# Altium project Hub_Unit - Copy.PrjPcb (part 1 of 2)
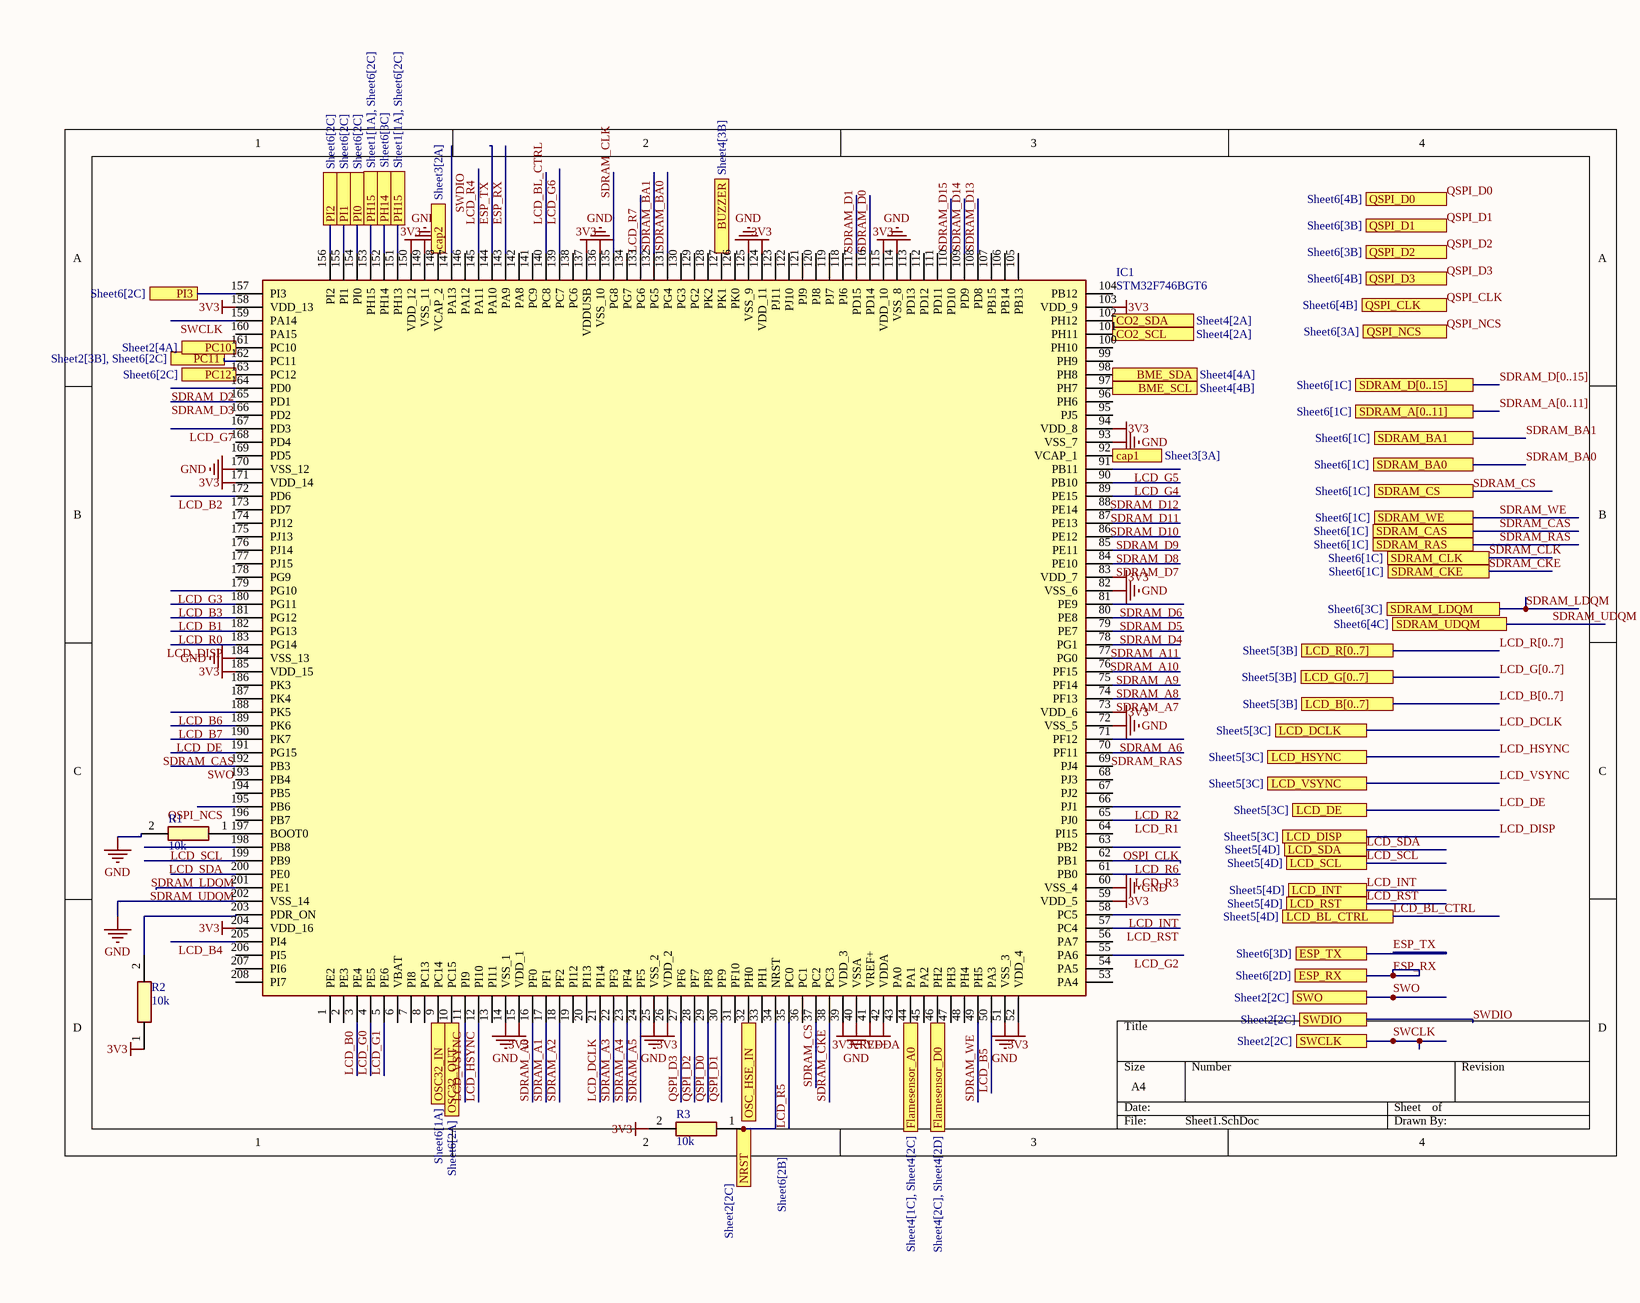
[diagram p0: Sheet1.SchDoc]
6 sheets, 122 parts. Net scope: flat (ports and power ports of the same name join across sheets).
Board file: PCB1.PcbDoc
Sheets:
  Sheet1.SchDoc
  Sheet2.SchDoc
  Sheet3.SchDoc
  Sheet4.SchDoc
  Sheet5.SchDoc
  Sheet6.SchDoc

## Sheet Sheet1.SchDoc
size A4; SheetNumber: 1; SheetTotal: 6

### Parts
IC1  STM32F746BGT6  [QFP50P3000X3000X160-208N]
R1  10k  [RESC1608X55N]
R2  10k  [RESC1608X55N]
R3  10k  [RESC1608X55N]

### Ports
BME_SCL (see Sheet4[4B]), BME_SDA (see Sheet4[4A]), BUZZER (see Sheet4[3B]), cap1 (see Sheet3[3A]), cap2 (see Sheet3[2A]), CO2_SCL (see Sheet4[2A]), CO2_SDA (see Sheet4[2A]), ESP_RX (see Sheet6[2D]), ESP_TX (see Sheet6[3D]), Flamesensor_A0 (see Sheet4[1C], Sheet4[2C]), Flamesensor_D0 (see Sheet4[2C], Sheet4[2D]), LCD_B[0..7] (see Sheet5[3B]), LCD_BL_CTRL (see Sheet5[4D]), LCD_DCLK (see Sheet5[3C]), LCD_DE (see Sheet5[3C]), LCD_DISP (see Sheet5[3C]), LCD_G[0..7] (see Sheet5[3B]), LCD_HSYNC (see Sheet5[3C]), LCD_INT (see Sheet5[4D]), LCD_R[0..7] (see Sheet5[3B]), LCD_RST (see Sheet5[4D]), LCD_SCL (see Sheet5[4D]), LCD_SDA (see Sheet5[4D]), LCD_VSYNC (see Sheet5[3C]), NRST (see Sheet2[2C]), OSC32_IN (see Sheet6[1A]), OSC32_OUT (see Sheet6[2A]), OSC_HSE_IN (see Sheet6[2B]), PC10 (see Sheet2[4A]), PC11 (see Sheet2[3B], Sheet6[2C]), PC12 (see Sheet6[2C]), PH14 (see Sheet6[3C]), PH15 (see Sheet1[1A], Sheet6[2C]), PI0 (see Sheet6[2C]), PI1 (see Sheet6[2C]), PI2 (see Sheet6[2C]), PI3 (see Sheet6[2C]), QSPI_CLK (see Sheet6[4B]), QSPI_D0 (see Sheet6[4B]), QSPI_D1 (see Sheet6[3B]), QSPI_D2 (see Sheet6[3B]), QSPI_D3 (see Sheet6[4B]), QSPI_NCS (see Sheet6[3A]), SDRAM_A[0..11] (see Sheet6[1C]), SDRAM_BA0 (see Sheet6[1C]), SDRAM_BA1 (see Sheet6[1C]), SDRAM_CAS (see Sheet6[1C]), SDRAM_CKE (see Sheet6[1C]), SDRAM_CLK (see Sheet6[1C]), SDRAM_CS (see Sheet6[1C]), SDRAM_D[0..15] (see Sheet6[1C]), SDRAM_LDQM (see Sheet6[3C]), SDRAM_RAS (see Sheet6[1C]), SDRAM_UDQM (see Sheet6[4C]), SDRAM_WE (see Sheet6[1C]), SWCLK (see Sheet2[2C]), SWDIO (see Sheet2[2C]), SWO (see Sheet2[2C])

### Nets
3V3: IC1.15(VDD_1) IC1.26(VDD_2) IC1.39(VDD_3) IC1.52(VDD_4) IC1.59(VDD_5) IC1.73(VDD_6) IC1.83(VDD_7) IC1.94(VDD_8) IC1.103(VDD_9) IC1.115(VDD_10) IC1.124(VDD_11) IC1.137(VDDUSB) IC1.150(VDD_12) IC1.158(VDD_13) IC1.171(VDD_14) IC1.185(VDD_15) IC1.204(VDD_16) R2.1 R3.2
GND: IC1.14(VSS_1) IC1.25(VSS_2) IC1.40(VSSA) IC1.51(VSS_3) IC1.60(VSS_4) IC1.72(VSS_5) IC1.82(VSS_6) IC1.93(VSS_7) IC1.114(VSS_8) IC1.125(VSS_9) IC1.136(VSS_10) IC1.149(VSS_11) IC1.170(VSS_12) IC1.184(VSS_13) IC1.202(VSS_14) R1.2
VDDA: IC1.42(VDDA)
VREF+: IC1.41(VREF+)
ESP_RX: IC1.143(PA9) ; port ESP_RX
ESP_TX: IC1.144(PA10) ; port ESP_TX
LCD_B0: IC1.3(PE4)
LCD_B1: IC1.181(PG12)
LCD_B2: IC1.172(PD6)
LCD_B3: IC1.180(PG11)
LCD_B4: IC1.205(PI4)
LCD_B5: IC1.50(PA3)
LCD_B6: IC1.188(PK5)
LCD_B7: IC1.189(PK6)
LCD_BL_CTRL: IC1.140(PC8) ; port LCD_BL_CTRL
LCD_DCLK: IC1.21(PI14) ; port LCD_DCLK
LCD_DE: IC1.190(PK7) ; port LCD_DE
LCD_DISP: IC1.183(PG14) ; port LCD_DISP
LCD_G0: IC1.4(PE5)
LCD_G1: IC1.5(PE6)
LCD_G2: IC1.55(PA6)
LCD_G3: IC1.179(PG10)
LCD_G4: IC1.90(PB10)
LCD_G5: IC1.91(PB11)
LCD_G6: IC1.139(PC7)
LCD_G7: IC1.167(PD3)
LCD_HSYNC: IC1.12(PI10) ; port LCD_HSYNC
LCD_INT: IC1.58(PC5) ; port LCD_INT
LCD_R0: IC1.182(PG13)
LCD_R1: IC1.65(PJ0)
LCD_R2: IC1.66(PJ1)
LCD_R3: IC1.61(PB0)
LCD_R4: IC1.145(PA11)
LCD_R5: IC1.35(PC0)
LCD_R6: IC1.62(PB1)
LCD_R7: IC1.133(PG6)
LCD_RST: IC1.57(PC4) ; port LCD_RST
LCD_SCL: IC1.198(PB8) ; port LCD_SCL
LCD_SDA: IC1.199(PB9) ; port LCD_SDA
LCD_VSYNC: IC1.11(PI9) ; port LCD_VSYNC
QSPI_CLK: IC1.63(PB2) ; port QSPI_CLK
QSPI_D0: IC1.29(PF8) ; port QSPI_D0
QSPI_D1: IC1.30(PF9) ; port QSPI_D1
QSPI_D2: IC1.28(PF7) ; port QSPI_D2
QSPI_D3: IC1.27(PF6) ; port QSPI_D3
QSPI_NCS: IC1.195(PB6) ; port QSPI_NCS
SDRAM_A0: IC1.16(PF0)
SDRAM_A1: IC1.17(PF1)
SDRAM_A2: IC1.18(PF2)
SDRAM_A3: IC1.22(PF3)
SDRAM_A4: IC1.23(PF4)
SDRAM_A5: IC1.24(PF5)
SDRAM_A6: IC1.71(PF12)
SDRAM_A7: IC1.74(PF13)
SDRAM_A8: IC1.75(PF14)
SDRAM_A9: IC1.76(PF15)
SDRAM_A10: IC1.77(PG0)
SDRAM_A11: IC1.78(PG1)
SDRAM_BA0: IC1.131(PG4) ; port SDRAM_BA0
SDRAM_BA1: IC1.132(PG5) ; port SDRAM_BA1
SDRAM_CAS: IC1.191(PG15) ; port SDRAM_CAS
SDRAM_CKE: IC1.38(PC3) ; port SDRAM_CKE
SDRAM_CLK: IC1.135(PG8) ; port SDRAM_CLK
SDRAM_CS: IC1.37(PC2) ; port SDRAM_CS
SDRAM_D0: IC1.116(PD14)
SDRAM_D1: IC1.117(PD15)
SDRAM_D2: IC1.164(PD0)
SDRAM_D3: IC1.165(PD1)
SDRAM_D4: IC1.79(PE7)
SDRAM_D5: IC1.80(PE8)
SDRAM_D6: IC1.81(PE9)
SDRAM_D7: IC1.84(PE10)
SDRAM_D8: IC1.85(PE11)
SDRAM_D9: IC1.86(PE12)
SDRAM_D10: IC1.87(PE13)
SDRAM_D11: IC1.88(PE14)
SDRAM_D12: IC1.89(PE15)
SDRAM_D13: IC1.108(PD8)
SDRAM_D14: IC1.109(PD9)
SDRAM_D15: IC1.110(PD10)
SDRAM_LDQM: IC1.200(PE0) ; port SDRAM_LDQM
SDRAM_RAS: IC1.70(PF11) ; port SDRAM_RAS
SDRAM_UDQM: IC1.201(PE1) ; port SDRAM_UDQM
SDRAM_WE: IC1.49(PH5) ; port SDRAM_WE
SWCLK: IC1.159(PA14) ; port SWCLK
SWDIO: IC1.147(PA13) ; port SWDIO
SWO: IC1.192(PB3) ; port SWO
NetC6_1: IC1.148(VCAP_2) ; port cap2
NetC7_1: IC1.92(VCAP_1) ; port cap1
NetC22_2: IC1.9(PC14) ; port OSC32_IN
NetC23_2: IC1.10(PC15) ; port OSC32_OUT
NetC41_2: IC1.44(PA1) ; port Flamesensor_A0
NetIC1_32: IC1.32(PH0) ; port OSC_HSE_IN
NetIC1_34: IC1.34(NRST) R3.1 ; port NRST
NetIC1_46: IC1.46(PH2) ; port Flamesensor_D0
NetIC1_97: IC1.97(PH7) ; port BME_SCL
NetIC1_98: IC1.98(PH8) ; port BME_SDA
NetIC1_101: IC1.101(PH11) ; port CO2_SCL
NetIC1_102: IC1.102(PH12) ; port CO2_SDA
NetIC1_127: IC1.127(PK1) ; port BUZZER
NetIC1_151: IC1.151(PH13) IC1.153(PH15) ; port PH15
NetIC1_152: IC1.152(PH14) ; port PH14
NetIC1_154: IC1.154(PI0) ; port PI0
NetIC1_155: IC1.155(PI1) ; port PI1
NetIC1_156: IC1.156(PI2) ; port PI2
NetIC1_157: IC1.157(PI3) ; port PI3
NetIC1_161: IC1.161(PC10) ; port PC10
NetIC1_162: IC1.162(PC11) ; port PC11
NetIC1_163: IC1.163(PC12) ; port PC12
NetIC1_197: IC1.197(BOOT0) R1.1
NetIC1_203: IC1.203(PDR_ON) R2.2

Not connected (* = marked no-connect by the designer): IC1 1(PE2) 2(PE3) 6(VBAT) 7(PI8) 8(PC13) 13(PI11) 19(PI12) 20(PI13) 31(PF10) 33(PH1) 36(PC1) 43(PA0) 45(PA2) 47(PH3) 48(PH4) 53(PA4) 54(PA5) 56(PA7) 64(PI15) 67(PJ2) 68(PJ3) 69(PJ4) 95(PJ5) 96(PH6) 99(PH9) 100(PH10) 104(PB12) 105(PB13) 106(PB14) 107(PB15) 111(PD11) 112(PD12) 113(PD13) 118(PJ6) 119(PJ7) 120(PJ8) 121(PJ9) 122(PJ10) 123(PJ11) 126(PK0) 128(PK2) 129(PG2) 130(PG3) 134(PG7) 138(PC6) 141(PC9) 142(PA8) 146(PA12) 160(PA15) 166(PD2) 168(PD4) 169(PD5) 173(PD7) 174(PJ12) 175(PJ13) 176(PJ14) 177(PJ15) 178(PG9) 186(PK3) 187(PK4) 193(PB4) 194(PB5) 196(PB7) 206(PI5) 207(PI6) 208(PI7)

### Buses and harness runs
bus LCD_B[0..7] = port LCD_B[0..7]
bus LCD_G[0..7] = port LCD_G[0..7]
bus LCD_R[0..7] = port LCD_R[0..7]
bus SDRAM_A[0..11] = port SDRAM_A[0..11]
bus SDRAM_D[0..15] = port SDRAM_D[0..15]

### Library data of the parts
IC1 = STM32F746BGT6: Integrated Circuit; Manufacturer_Name: STMicroelectronics; Datasheet Link: https://www.st.com/resource/en/datasheet/stm32f746bg.pdf; Height: 1.6mm; Manufacturer_Part_Number: STM32F746BGT6; Mouser Part Number: 511-STM32F746BGT6; Mouser Price/Stock: https://www.mouser.co.uk/ProductDetail/STMicroelectronics/STM32F746BGT6?qs=E2FFEhwHWtcSD54rSf3kgw%3D%3D; Arrow Part Number: STM32F746BGT6; Arrow Price/Stock: https://www.arrow.com/en/products/stm32f746bgt6/stmicroelectronics?utm_currency=USD&region=nac
R1-R3 = RC0603FR-071KL: Resistor; Manufacturer_Name: YAGEO; Datasheet Link: https://www.yageo.com/upload/media/product/productsearch/datasheet/rchip/PYu-RC_Group_51_RoHS_L_12.pdf; Height: 0.55mm; Manufacturer_Part_Number: RC0603FR-071KL; Mouser Part Number: 603-RC0603FR-071KL; Mouser Price/Stock: https://www.mouser.co.uk/ProductDetail/YAGEO/RC0603FR-071KL?qs=VU8sRB4EgwApHsk4rF%2F3zg%3D%3D; Arrow Part Number: RC0603FR-071KL; Arrow Price/Stock: https://www.arrow.com/en/products/rc0603fr-071kl/yageo?utm_currency=USD&region=nac

## Sheet Sheet2.SchDoc
size A4; SheetNumber: 2; SheetTotal: 6
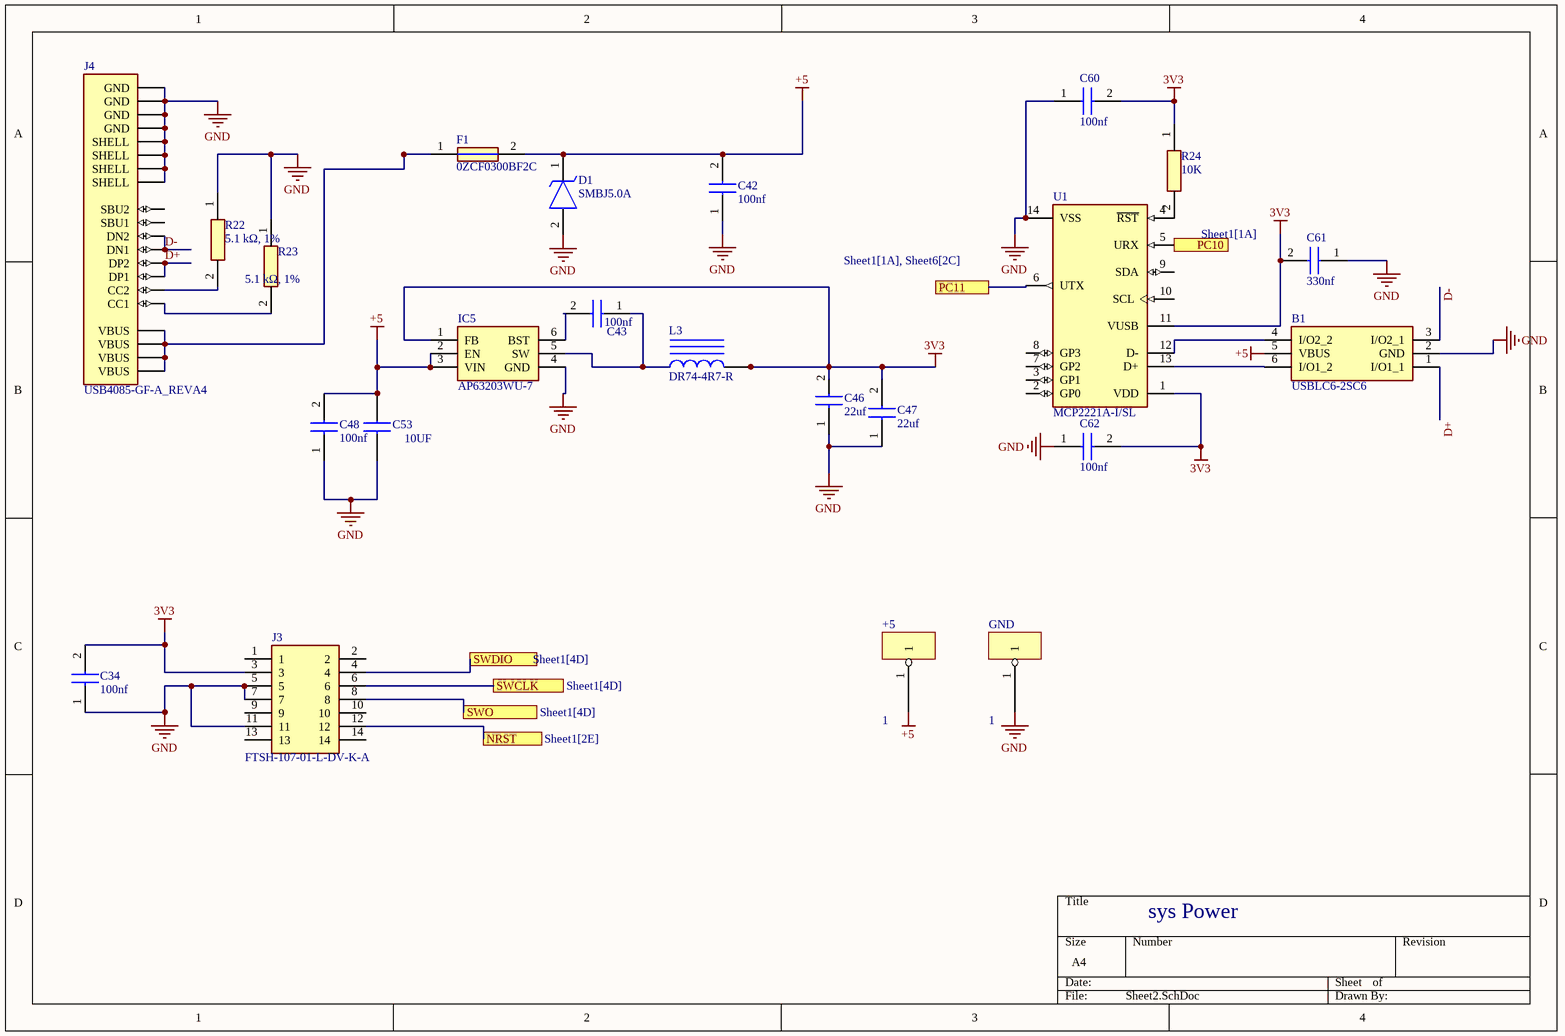
[diagram p1: Sheet2.SchDoc]

### Parts
+5  1  [ANT]
B1  USBLC6-2SC6  [SOT95P280X145-6N]
C34  100nf  [CAPC1608X95N]
C42  100nf  [CAPC1608X95N]
C43  100nf  [CAPC1608X95N]
C46  22uf  [CAPC1608X95N]
C47  22uf  [CAPC1608X95N]
C48  100nf  [CAPC1608X95N]
C53  10UF  [CAPC1608X90N]
C60  100nf  [CAPC1608X95N]
C61  330nf  [CAPC1608X95N]
C62  100nf  [CAPC1608X95N]
D1  SMBJ5.0A  [SMBJ12A]
F1  0ZCF0300BF2C  [FUSC7451X115N]
GND  1  [ANT]
IC5  AP63203WU-7  [AP63203WU7]
J3  FTSH-107-01-L-DV-K-A  [FTSH-107-XX-YYY-DV-K-A]
J4  USB4085-GF-A_REVA4  [GCT_USB4085-GF-A_REVA4]
L3  DR74-4R7-R  [COBU-DR74-4R7-R_V]
R22  5.1 kΩ, 1%  [RESC1608X55N]
R23  5.1 kΩ, 1%  [RESC1608X55N]
R24  10K  [RESC1608X55N]
U1  MCP2221A-I/SL  [FP-C04-065-SL-MFG]

### Ports
NRST (see Sheet1[2E]), PC10 (see Sheet1[1A]), PC11 (see Sheet1[1A], Sheet6[2C]), SWCLK (see Sheet1[4D]), SWDIO (see Sheet1[4D]), SWO (see Sheet1[4D])

### Nets
3V3: C34.2 C46.2 C47.2 C60.2 C61.2 C62.2 IC5.1(FB) J3.3 L3.2 R24.1 U1.1(VDD) U1.11(VUSB)
+5: +5.1 B1.5(VBUS) C42.2 C48.2 C53.2 D1.1(K) F1.2 IC5.2(EN) IC5.3(VIN)
GND: B1.2(GND) C34.1 C42.1 C46.1 C47.1 C48.1 C53.1 C60.1 C61.1 C62.1 D1.2(A) GND.1 IC5.4(GND) J3.5 J3.7 J3.11 J4.A1(GND) J4.A12(GND) J4.B1(GND) J4.B12(GND) J4.S1(SHELL) J4.S2(SHELL) J4.S3(SHELL) J4.S4(SHELL) R22.1 R23.1 U1.14(VSS)
D+: B1.1(I/O1_1) J4.A6(DP1) J4.B6(DP2)
D-: B1.3(I/O2_1) J4.A7(DN1) J4.B7(DN2)
SWCLK: J3.6 ; port SWCLK
SWDIO: J3.4 ; port SWDIO
SWO: J3.8 ; port SWO
NetB1_4: B1.4(I/O2_2) U1.12(D-)
NetB1_6: B1.6(I/O1_2) U1.13(D+)
NetC43_1: C43.1 IC5.5(SW) L3.1
NetC43_2: C43.2 IC5.6(BST)
NetF1_1: F1.1 J4.A4(VBUS) J4.A9(VBUS) J4.B4(VBUS) J4.B9(VBUS)
NetIC1_34: J3.12 ; port NRST
NetIC1_161: U1.5(URX) ; port PC10
NetIC1_162: U1.6(UTX) ; port PC11
NetJ4_A5: J4.A5(CC1) R23.2
NetJ4_B5: J4.B5(CC2) R22.2
NetR24_2: R24.2 U1.4(~{RST})

Not connected (* = marked no-connect by the designer): J3 1 2 9 10 13 14; J4 A8(SBU1) B8(SBU2); U1 2(GP0) 3(GP1) 7(GP2) 8(GP3) 9(SDA) 10(SCL)

### Notes on the sheet
- sys Power

### Library data of the parts
B1 = USBLC6-2SC6: TVS Diode Array Uni-Directional USBLC6-2SC6 17V, SOT-23 6-Pin; Manufacturer_Name: STMicroelectronics; Geometry.Height: 1.45mm; Manufacturer_Part_Number: USBLC6-2SC6; Mouser Part Number: 511-USBLC6-2SC6; Mouser Price/Stock: https://www.mouser.co.uk/ProductDetail/STMicroelectronics/USBLC6-2SC6?qs=po45yt2pPpu%2FhNIlwQdTlg%3D%3D; Arrow Part Number: USBLC6-2SC6; Arrow Price/Stock: https://www.arrow.com/en/products/usblc6-2sc6/stmicroelectronics.html?utm_currency=USD&region=nac; Datasheet Link: https://www.st.com/resource/en/datasheet/usblc6-2.pdf
C34 C42 C43 C46-C48 C60-C62 = VJ0603Y104KXACW1BC: Capacitor; Manufacturer_Name: Vishay; Datasheet Link: https://componentsearchengine.com/Datasheets/2/VJ0603Y104KXACW1BC.pdf; Height: 0.95mm; Manufacturer_Part_Number: VJ0603Y104KXACW1BC; Mouser Part Number: N/A; Mouser Price/Stock: https://www.mouser.co.uk/ProductDetail/Vishay-Vitramon/VJ0603Y104KXACW1BC?qs=M%2FcR%2FDpCXFVPJpohemA31Q%3D%3D; Arrow Part Number: VJ0603Y104KXACW1BC; Arrow Price/Stock: https://www.arrow.com/en/products/vj0603y104kxacw1bc/vishay?utm_currency=USD&region=nac
C53 = CL10A106KP8NNNC: 10F +/-10% 10V Ceramic Capacitor X5R 0603 (1608 Metric); Manufacturer_Name: SAMSUNG; Geometry.Height: 0.9mm; Manufacturer_Part_Number: CL10A106KP8NNNC; Mouser Part Number: 187-CL10A106KP8NNNC; Mouser Price/Stock: https://www.mouser.co.uk/ProductDetail/Samsung-Electro-Mechanics/CL10A106KP8NNNC?qs=X6jEic%2FHinAlyfRHj7fKwg%3D%3D; Arrow Part Number: CL10A106KP8NNNC; Arrow Price/Stock: https://www.arrow.com/en/products/cl10a106kp8nnnc/samsung-electro-mechanics?utm_currency=USD&region=europe; Datasheet Link: https://datasheet.datasheetarchive.com/originals/distributors/Datasheets-DGA10/2415998.pdf
D1 = SMBJ5.0A: TVS Diode (Uni-directional); Manufacturer_Name: STMicroelectronics; Datasheet Link: https://www.st.com/resource/en/datasheet/smbj12a.pdf; Height: 2.45mm; Manufacturer_Part_Number: SMBJ5.0A
F1 = 0ZCF0300BF2C: Fuse; Manufacturer_Name: BelFuse; Datasheet Link: https://componentsearchengine.com/Datasheets/1/0ZCF0300BF2C.pdf; Height: 1.15mm; Manufacturer_Part_Number: 0ZCF0300BF2C; Mouser Part Number: 530-0ZCF0300BF2C; Mouser Price/Stock: https://www.mouser.co.uk/ProductDetail/Bel-Fuse/0ZCF0300BF2C?qs=jyPKP7YLNfCnIt8PHbsbtw%3D%3D; Arrow Part Number: 0ZCF0300BF2C; Arrow Price/Stock: https://www.arrow.com/en/products/0zcf0300bf2c/bel-group
IC5 = AP63203WU-7: Integrated Circuit; Manufacturer_Name: Diodes Incorporated; Datasheet Link: https://www.diodes.com/assets/Datasheets/AP63200-AP63201-AP63203-AP63205.pdf; Height: 1mm; Manufacturer_Part_Number: AP63203WU-7; Mouser Part Number: 621-AP63203WU-7; Mouser Price/Stock: https://www.mouser.co.uk/ProductDetail/Diodes-Incorporated/AP63203WU-7?qs=u16ybLDytRZ1JqxbuLkMJw%3D%3D; Arrow Part Number: AP63203WU-7; Arrow Price/Stock: https://www.arrow.com/en/products/ap63203wu-7/diodes-incorporated?utm_currency=USD&region=europe
J3 = FTSH-107-01-L-DV-K-A: Connector; Manufacturer_Name: SAMTEC; Datasheet Link: http://suddendocs.samtec.com/prints/ftsh-1xx-xx-xxx-dv-xxx-xxx-mkt.pdf; Manufacturer_Part_Number: FTSH-107-01-L-DV-K-A; Mouser Part Number: 200-FTSH10701LDVKA; Mouser Price/Stock: https://www.mouser.co.uk/ProductDetail/Samtec/FTSH-107-01-L-DV-K-A?qs=PB6%2FjmICvI3xEHFou4PhNg%3D%3D; Arrow Part Number: FTSH-107-01-L-DV-K-A; Arrow Price/Stock: https://www.arrow.com/en/products/ftsh-107-01-l-dv-k-a/samtec?utm_currency=USD&region=europe
J4 = USB4085-GF-A_REVA4: USB-C (USB TYPE-C) USB 2.0 Receptacle Connector 24 (16+8 Dummy) Position Through Hole, Right Angle, low cost, 3.46mm profile, 16 pin, horizontal, Top mount; MF: Global Connector Technology; SnapEDA_Link: https://www.snapeda.com/parts/USB4085-GF-A/Global+Connector+Technology/view-part/?ref=snap; Package: None; MP: USB4085-GF-A; Check_prices: https://www.snapeda.com/parts/USB4085-GF-A/Global+Connector+Technology/view-part/?ref=eda; Purchase-URL: https://pricing.snapeda.com/search/part/USB4085-GF-A/?ref=eda; Price: None; Value: *; Availability: In Stock
L3 = CMP-2000-06180-1: High Power Density, High Efficiency, Shielded Inductor, 4.7 uH, -40 to 125 degC, RoHS, Tape and Reel; Manufacturer: Eaton; Tolerance: ±20%; Current - Saturation: 4.37A; Type: Wirewound; Frequency - Test: 100kHz; Current Rating: 3.34A; DC Resistance (DCR): 25.4mOhm; Inductance: 4.7µH; Material - Core: Ferrite; Package Reference: DR74-4R7-R; Ratings: -; Frequency - Self Resonant: -; Operating Temperature: -40°C~125°C; Family: FixedInductors; Package / Case: Nonstandard; Mounting Type: SurfaceMount; Series: DR; Q @ Freq: -; Datasheet Version: 12/2012; Package Description: 2-Pin Surface Mount Device, Body 7.6 x 7.6 mm; Height - Seated (Max): 0.171"(4.35mm); Datasheet URL: https://datasheet.ciiva.com/14667/0900766b8116a153-14667792.pdf; Packaging: Tape&amp;Reel(TR); Manufacturer URL: http://www.cooperindustries.com/content/public/en/bussmann/electronics.html; Mounting Technology: SurfaceMount; Size / Dimension: 0.299"Lx0.299"W(7.60mmx7.60mm); Category: Inductors,Coils,Chokes; Shielding: Shielded
R22-R24 = RC0603FR-071KL: Resistor; Manufacturer_Name: YAGEO; Datasheet Link: https://www.yageo.com/upload/media/product/productsearch/datasheet/rchip/PYu-RC_Group_51_RoHS_L_12.pdf; Height: 0.55mm; Manufacturer_Part_Number: RC0603FR-071KL; Mouser Part Number: 603-RC0603FR-071KL; Mouser Price/Stock: https://www.mouser.co.uk/ProductDetail/YAGEO/RC0603FR-071KL?qs=VU8sRB4EgwApHsk4rF%2F3zg%3D%3D; Arrow Part Number: RC0603FR-071KL; Arrow Price/Stock: https://www.arrow.com/en/products/rc0603fr-071kl/yageo?utm_currency=USD&region=nac
U1 = CMP-06284-000011-1: IC USB TO I2C/UART 14SOIC; Manufacturer: Microchip; Min Supply Voltage: 3V; Usb Standard: USB 2.0; Max Supply Voltage: 5.5V; Nominal Supply Current: 10-13mA; Automotive Grade: Grade 3; Interface: I2C,UART,USB; Standoff Height: 0.1mm; Max Junction Temp: +150°C; Data Rate: 12Mbits/s; Lead Free: Yes; Height: 1.75mm; Octopart: https://octopart.com/mcp2221a-i%2Fsl-microchip-71704986; Package: C04-065-SL; Digikey Description: IC USB TO I2C/UART 14SOIC; Temperature Range Low: -40°C; Temperature: -40°C to +85°C; Category: IC; Temperature Range High: +85°C; Ambient Temperature Range Low: -40°C; Device Class L1: Integrated Circuits (ICs); Footprint Url: http://ww1.microchip.com/downloads/en/DeviceDoc/14L%20SOIC%203_90%20mm%20%28SL%29%20C04-00065d.pdf; Automotive: Yes; ComponentLink2URL: http://ww1.microchip.com/downloads/en/DeviceDoc/20005565B.pdf; Ambient Temperature Range High: +85°C; RoHS: TRUE; Device Class L3: USB Interface ICs; ComponentLink2Description: Datasheet; Device Class L2: Interface ICs; Manufacturer Part Number: MCP2221A-I/SL; Ipc Land Pattern Name: SOIC127P600X175-14

## Sheet Sheet3.SchDoc
size A4; SheetNumber: 3; SheetTotal: 6
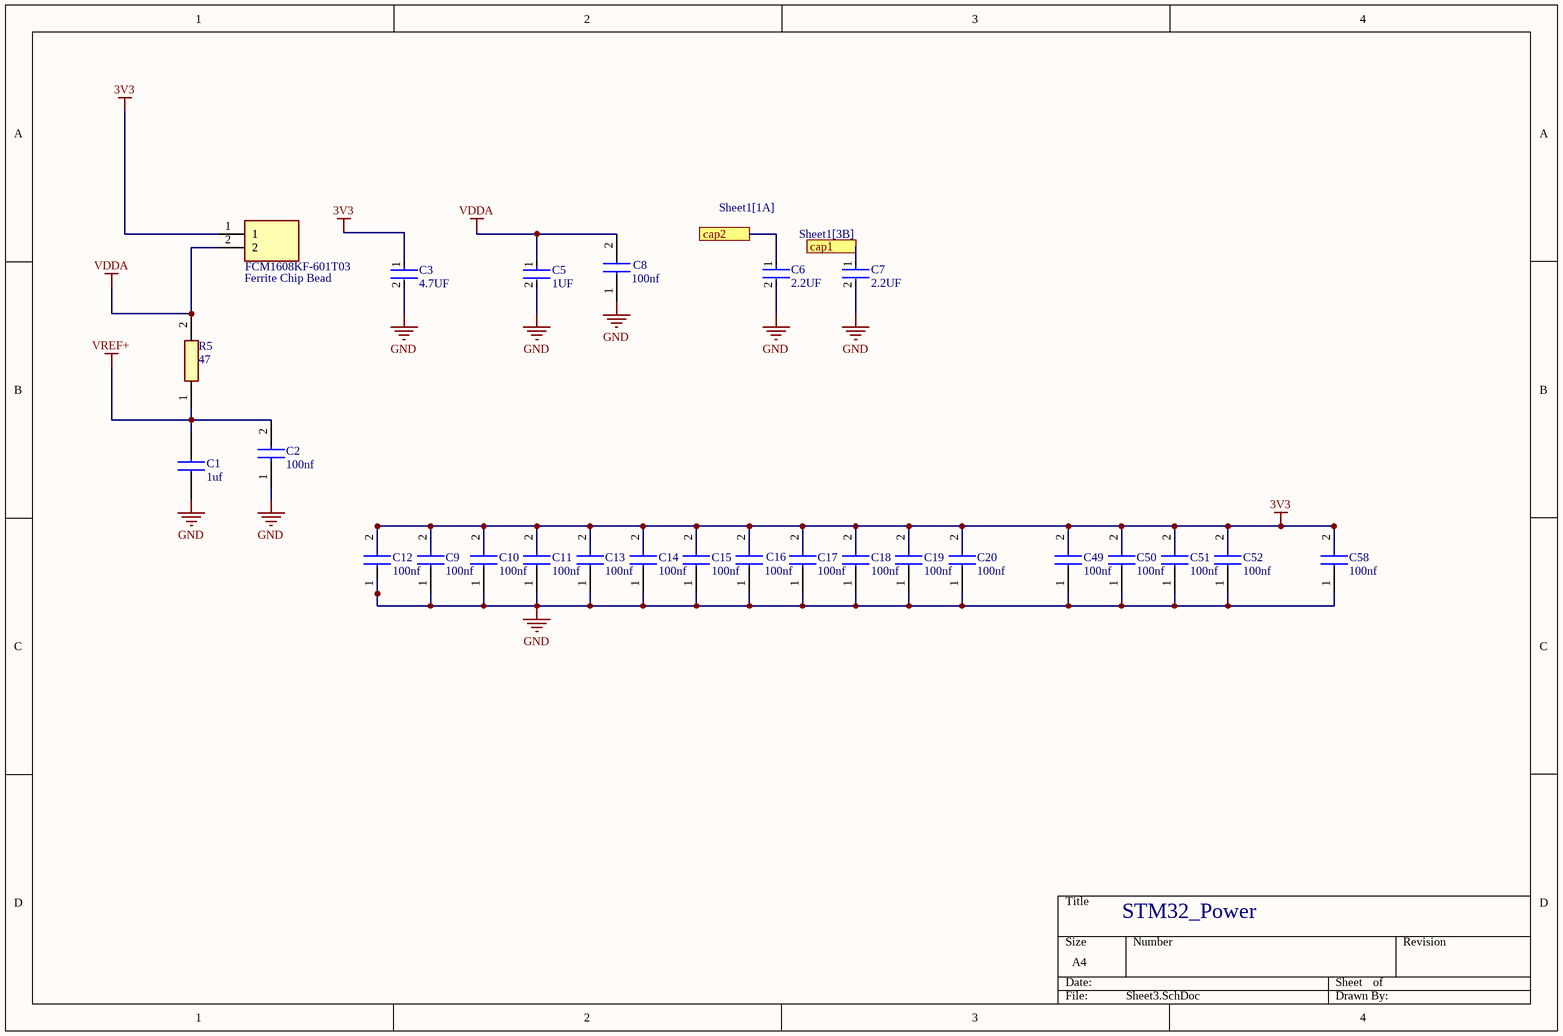
[diagram p2: Sheet3.SchDoc]

### Parts
C1  1uf  [CAPC1608X95N]
C2  100nf  [CAPC1608X95N]
C3  4.7UF  [FP-CL10-IPC_A]
C5  1UF  [FP-CL10-IPC_A]
C6  2.2UF  [FP-CL10-IPC_A]
C7  2.2UF  [FP-CL10-IPC_A]
C8  100nf  [CAPC1608X95N]
C9  100nf  [CAPC1608X95N]
C10  100nf  [CAPC1608X95N]
C11  100nf  [CAPC1608X95N]
C12  100nf  [CAPC1608X95N]
C13  100nf  [CAPC1608X95N]
C14  100nf  [CAPC1608X95N]
C15  100nf  [CAPC1608X95N]
C16  100nf  [CAPC1608X95N]
C17  100nf  [CAPC1608X95N]
C18  100nf  [CAPC1608X95N]
C19  100nf  [CAPC1608X95N]
C20  100nf  [CAPC1608X95N]
C49  100nf  [CAPC1608X95N]
C50  100nf  [CAPC1608X95N]
C51  100nf  [CAPC1608X95N]
C52  100nf  [CAPC1608X95N]
C58  100nf  [CAPC1608X95N]
Ferrite_Chip_Bead  FCM1608KF-601T03  [BEADC1608X95N]
R5  47  [RESC1608X55N]

### Ports
cap1 (see Sheet1[3B]), cap2 (see Sheet1[1A])

### Nets
3V3: C3.1 C9.2 C10.2 C11.2 C12.2 C13.2 C14.2 C15.2 C16.2 C17.2 C18.2 C19.2 C20.2 C49.2 C50.2 C51.2 C52.2 C58.2 Ferrite_Chip_Bead.1
GND: C1.1 C2.1 C3.2 C5.2 C6.2 C7.2 C8.1 C9.1 C10.1 C11.1 C12.1 C13.1 C14.1 C15.1 C16.1 C17.1 C18.1 C19.1 C20.1 C49.1 C50.1 C51.1 C52.1 C58.1
VDDA: C5.1 C8.2 Ferrite_Chip_Bead.2 R5.2
VREF+: C1.2 C2.2 R5.1
NetC6_1: C6.1 ; port cap2
NetC7_1: C7.1 ; port cap1

### Notes on the sheet
- STM32_Power

### Library data of the parts
C1 = 0603X105K250CT: WALSIN - 0603X105K250CT - SMD Multilayer Ceramic Capacitor, 1 F, 25 V, 0603 [1608 Metric], +/- 10%, X5R; Manufacturer_Name: Walsin Technology Corporation; Geometry.Height: 0.95mm; Manufacturer_Part_Number: 0603X105K250CT; Mouser Part Number: *; Mouser Price/Stock: *; Arrow Part Number: *; Arrow Price/Stock: *; Datasheet Link: https://g.componentsearchengine.com/Datasheets/2/0603X105K250CT.pdf
C2 C8-C20 C49-C52 C58 = VJ0603Y104KXACW1BC: Capacitor; Manufacturer_Name: Vishay; Datasheet Link: https://componentsearchengine.com/Datasheets/2/VJ0603Y104KXACW1BC.pdf; Height: 0.95mm; Manufacturer_Part_Number: VJ0603Y104KXACW1BC; Mouser Part Number: N/A; Mouser Price/Stock: https://www.mouser.co.uk/ProductDetail/Vishay-Vitramon/VJ0603Y104KXACW1BC?qs=M%2FcR%2FDpCXFVPJpohemA31Q%3D%3D; Arrow Part Number: VJ0603Y104KXACW1BC; Arrow Price/Stock: https://www.arrow.com/en/products/vj0603y104kxacw1bc/vishay?utm_currency=USD&region=nac
C3 C5-C7 = CMP-13271-003582-1: Cap Ceramic 2.2uF 10V X7R ±10% Pad SMD 0603 +125°C T/R; Max Operating Temperature: 125°C; Package Quantity: 1; Thickness: 0.035inch; Capacitance: 2.2uF; Height: 0.8mm; Case/Package: 0603; Case Code (Metric): 1608; Radiation Hardening: No; Dielectric: X7R; Mount: Surface Mount; Contact Plating: Tin; Material: Ceramic; Length: 1.6mm; Packaging: Tape and Reel; Width: 0.031inch; Min Operating Temperature: -55°C; Case Code (Imperial): 0603; Depth: 0.8mm; Voltage Rating: 10V; Tolerance: 10%
Ferrite_Chip_Bead = FCM1608KF-601T03: Ferrite Bead; Manufacturer_Name: TAI-TECH; Datasheet Link: https://www.tai-tech.com.tw/_upload/files/FCM1608-Series.pdf; Height: 0.95mm; Manufacturer_Part_Number: FCM1608KF-601T03
R5 = RC0603FR-071KL: Resistor; Manufacturer_Name: YAGEO; Datasheet Link: https://www.yageo.com/upload/media/product/productsearch/datasheet/rchip/PYu-RC_Group_51_RoHS_L_12.pdf; Height: 0.55mm; Manufacturer_Part_Number: RC0603FR-071KL; Mouser Part Number: 603-RC0603FR-071KL; Mouser Price/Stock: https://www.mouser.co.uk/ProductDetail/YAGEO/RC0603FR-071KL?qs=VU8sRB4EgwApHsk4rF%2F3zg%3D%3D; Arrow Part Number: RC0603FR-071KL; Arrow Price/Stock: https://www.arrow.com/en/products/rc0603fr-071kl/yageo?utm_currency=USD&region=nac

## Sheet Sheet4.SchDoc
size A4; SheetNumber: 4; SheetTotal: 6
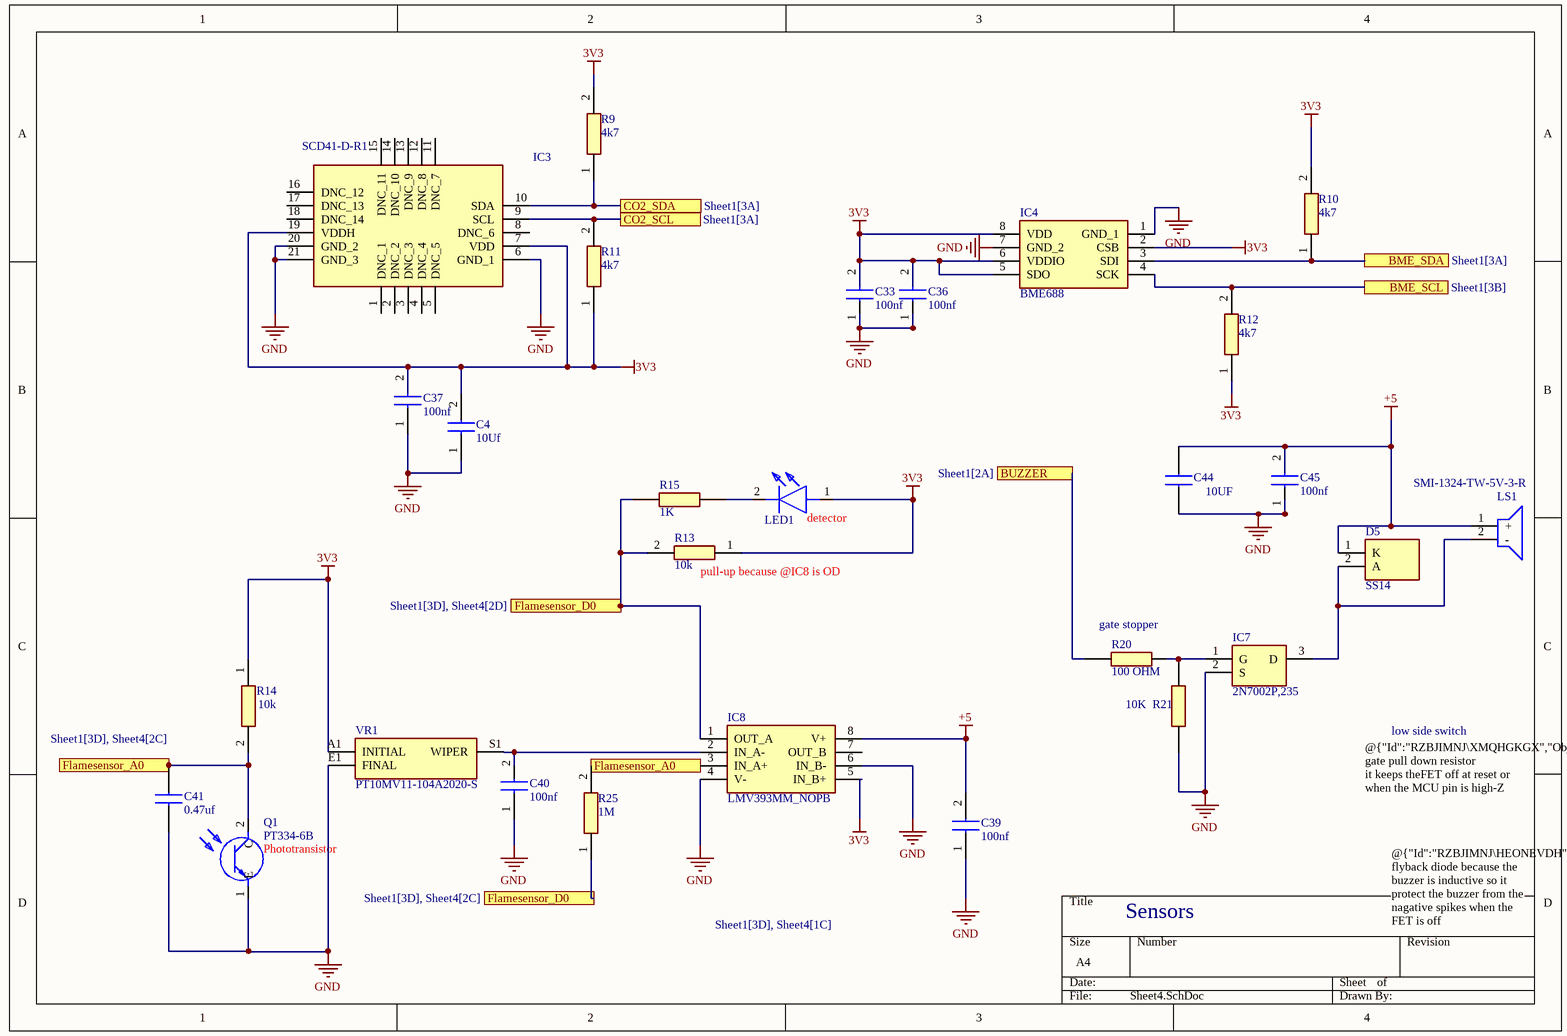
[diagram p3: Sheet4.SchDoc]

### Parts
C4  10Uf  [CAPC1608X95N]
C33  100nf  [CAPC1608X95N]
C36  100nf  [CAPC1608X95N]
C37  100nf  [CAPC1608X95N]
C39  100nf  [CAPC1608X95N]
C40  100nf  [CAPC1608X95N]
C41  0.47uf  [CAPC1608X90N]
C44  10UF  [CAPC1608X90N]
C45  100nf  [CAPC1608X95N]
D5  SS14  [DIOM5026X262N]
IC3  SCD41-D-R1  [SCD41DR1]
IC4  BME688  [BME688]
IC7  2N7002P,235  [SOT95P230X110-3N]
IC8  LMV393MM_NOPB  [SOP65P490X110-8N]
LED1  KPTL-3216SURCK-01-VS  [KPTL3216SURCK01VS]  (value not drawn)
LS1  SMI-1324-TW-5V-3-R  [SMI1324TW5V3R]
Q1  PT334-6B  [PT3346B]
R9  4k7  [RESC1608X55N]
R10  4k7  [RESC1608X55N]
R11  4k7  [RESC1608X55N]
R12  4k7  [RESC1608X55N]
R13  10k  [RESC1608X55N]
R14  10k  [RESC1608X55N]
R15  1K  [RESC1608X50N]
R20  100 OHM  [RESC1608X55N]
R21  10K  [RESC1608X50N]
R25  1M  [RESC1608X55N]
VR1  PT10MV11-104A2020-S  [PT10MV11104A2020S]

### Ports
BME_SCL (see Sheet1[3B]), BME_SDA (see Sheet1[3A]), BUZZER (see Sheet1[2A]), CO2_SCL (see Sheet1[3A]), CO2_SDA (see Sheet1[3A]), Flamesensor_A0 (see Sheet1[3D], Sheet4[1C]), Flamesensor_A0 (see Sheet1[3D], Sheet4[2C]), Flamesensor_D0 (see Sheet1[3D], Sheet4[2C]), Flamesensor_D0 (see Sheet1[3D], Sheet4[2D])

### Nets
3V3: C4.2 C33.2 C36.2 C37.2 IC3.7(VDD) IC3.19(VDDH) IC4.2(CSB) IC4.5(SDO) IC4.6(VDDIO) IC4.8(VDD) IC8.5(IN_B+) LED1.1(A) R9.2 R10.2 R11.1 R12.1 R13.1 R14.1 VR1.A1(INITIAL)
+5: C39.2 C44.2 C45.2 D5.1(K) IC8.8(V+) LS1.1(+)
GND: C4.1 C33.1 C36.1 C37.1 C39.1 C40.1 C41.1 C44.1 C45.1 IC3.6(GND_1) IC3.20(GND_2) IC3.21(GND_3) IC4.1(GND_1) IC4.7(GND_2) IC7.2(S) IC8.4(V-) IC8.6(IN_B-) Q1.1(E) R21.1 VR1.E1(FINAL)
NetC40_2: C40.2 IC8.2(IN_A-) VR1.S1(WIPER)
NetC41_2: C41.2 IC8.3(IN_A+) Q1.2(C) R14.2 R25.2 ; port Flamesensor_A0
NetD5_2: D5.2(A) IC7.3(D) LS1.2(-)
NetIC1_46: IC8.1(OUT_A) R13.2 R15.1 R25.1 ; port Flamesensor_D0
NetIC1_97: IC4.4(SCK) R12.2 ; port BME_SCL
NetIC1_98: IC4.3(SDI) R10.1 ; port BME_SDA
NetIC1_101: IC3.9(SCL) R11.2 ; port CO2_SCL
NetIC1_102: IC3.10(SDA) R9.1 ; port CO2_SDA
NetIC1_127: R20.1 ; port BUZZER
NetIC7_1: IC7.1(G) R20.2 R21.2
NetLED1_2: LED1.2(K) R15.2

Not connected (* = marked no-connect by the designer): IC3 1(DNC_1) 2(DNC_2) 3(DNC_3) 4(DNC_4) 5(DNC_5) 8(DNC_6) 11(DNC_7) 12(DNC_8) 13(DNC_9) 14(DNC_10) 15(DNC_11) 16(DNC_12) 17(DNC_13) 18(DNC_14); IC8 7(OUT_B)

### Notes on the sheet
- (near R13) pull-up because @IC8 is OD
- (near LED1) detector
- (near R20) gate stopper
- low side switch
- (near Q1) Phototransistor
- @{"Id":"RZBJIMNJ\XMQHGKGX","ObjectType":2} gate pull down resistor                                                              it keeps theFET off at reset or when the MCU pin is high-Z
- Sensors
- @{"Id":"RZBJIMNJ\HEONEVDH","ObjectType":2}
  flyback diode because the buzzer is inductive so it protect the buzzer from the nagative spikes when the FET is off

### Library data of the parts
C4 C33 C36 C37 C39 C40 C45 = VJ0603Y104KXACW1BC: Capacitor; Manufacturer_Name: Vishay; Datasheet Link: https://componentsearchengine.com/Datasheets/2/VJ0603Y104KXACW1BC.pdf; Height: 0.95mm; Manufacturer_Part_Number: VJ0603Y104KXACW1BC; Mouser Part Number: N/A; Mouser Price/Stock: https://www.mouser.co.uk/ProductDetail/Vishay-Vitramon/VJ0603Y104KXACW1BC?qs=M%2FcR%2FDpCXFVPJpohemA31Q%3D%3D; Arrow Part Number: VJ0603Y104KXACW1BC; Arrow Price/Stock: https://www.arrow.com/en/products/vj0603y104kxacw1bc/vishay?utm_currency=USD&region=nac
C41 = CC0603KRX7R6BB474: Phycomp 0603 Standard 470nF Ceramic Multilayer Capacitor, 10 V dc, +125C, X7R Dielectric, +/-10% SMD; Manufacturer_Name: KEMET; Geometry.Height: 0.9mm; Manufacturer_Part_Number: CC0603KRX7R6BB474; Mouser Part Number: 603-CC603KRX7R6BB474; Mouser Price/Stock: https://www.mouser.com/Search/Refine.aspx?Keyword=603-CC603KRX7R6BB474; Arrow Part Number: CC0603KRX7R6BB474; Arrow Price/Stock: https://www.arrow.com/en/products/cc0603krx7r6bb474/yageo; Datasheet Link: https://www.yageo.com/upload/media/product/productsearch/datasheet/mlcc/UPY-NP0X7R_MV_100-to-630V_24.pdf
C44 = CL10A106KP8NNNC: as C53 on sheet Sheet2; Manufacturer_Part_Number: CL10A106KP8NNNC; Mouser Part Number: 187-CL10A106KP8NNNC; Mouser Price/Stock: https://www.mouser.co.uk/ProductDetail/Samsung-Electro-Mechanics/CL10A106KP8NNNC?qs=X6jEic%2FHinAlyfRHj7fKwg%3D%3D; Arrow Part Number: CL10A106KP8NNNC; Arrow Price/Stock: https://www.arrow.com/en/products/cl10a106kp8nnnc/samsung-electro-mechanics?utm_currency=USD&region=europe; Datasheet Link: https://datasheet.datasheetarchive.com/originals/distributors/Datasheets-DGA10/2415998.pdf
D5 = SS14: Battery; Manufacturer_Name: HY Electronic; Datasheet Link: http://uk.rs-online.com/web/p/products/1711446; Height: 2.62mm; Manufacturer_Part_Number: SS14
IC3 = SCD41-D-R1: Integrated Circuit; Manufacturer_Name: Sensirion; Datasheet Link: https://sensirion.com/media/documents/48C4B7FB/64C134E7/Sensirion_SCD4x_Datasheet.pdf; Height: 6.8mm; Manufacturer_Part_Number: SCD41-D-R1; Mouser Part Number: 403-SCD41-D-R1; Mouser Price/Stock: https://www.mouser.co.uk/ProductDetail/Sensirion/SCD41-D-R1?qs=HBWAp0VN4Rg1hR6vTmplbw%3D%3D; Arrow Part Number: SCD41-D-R1; Arrow Price/Stock: https://www.arrow.com/en/products/scd41-d-r1/sensirion-ag?utm_currency=USD&region=nac
IC4 = BME688: Integrated Circuit; Manufacturer_Name: BOSCH; Datasheet Link: https://www.bosch-sensortec.com/media/boschsensortec/downloads/datasheets/bst-bme688-ds000.pdf; Height: 1mm; Manufacturer_Part_Number: BME688; Mouser Part Number: 262-BME688; Mouser Price/Stock: https://www.mouser.co.uk/ProductDetail/Bosch-Sensortec/BME688?qs=IS%252B4QmGtzzqQoVDscqwx3A%3D%3D; Arrow Part Number: BME688; Arrow Price/Stock: https://www.arrow.com/en/products/bme688/bosch-sensortec?utm_currency=USD&region=nac
IC7 = 2N7002P,235: Integrated Circuit; Manufacturer_Name: Nylofix; Datasheet Link: https://4donline.ihs.com/images/VipMasterIC/IC/PHGL/PHGLS21946/PHGLS21946-1.pdf?hkey=EF798316E3902B6ED9A73243A3159BB0; Height: 1.1mm; Manufacturer_Part_Number: 2N7002P,235
IC8 = LMV393MM_NOPB: Integrated Circuit; Manufacturer_Name: Texas Instruments; Manufacturer_Part_Number: LMV393MM/NOPB; Datasheet Link: http://www.ti.com/lit/ds/symlink/lmv393-n.pdf; Height: 1.1mm; Mouser Part Number: 926-LMV393MM/NOPB; Mouser Price/Stock: https://www.mouser.co.uk/ProductDetail/Texas-Instruments/LMV393MM-NOPB?qs=7lkVKPoqpbZkPkHa4IaJJg%3D%3D; Arrow Part Number: LMV393MM/NOPB; Arrow Price/Stock: https://www.arrow.com/en/products/lmv393mmnopb/texas-instruments
LED1 = KPTL-3216SURCK-01-VS: LED; Manufacturer_Name: Kingbright; Datasheet Link: http://www.farnell.com/datasheets/1655872.pdf; Height: 1.2mm; Manufacturer_Part_Number: KPTL-3216SURCK-01-VS; Mouser Part Number: N/A; Mouser Price/Stock: https://www.mouser.co.uk/ProductDetail/Kingbright/KPTL-3216SURCK-01-VS?qs=5DWHFlm3M2sATWsF9Oia%2FA%3D%3D
LS1 = SMI-1324-TW-5V-3-R: Loudspeaker or Buzzer; Manufacturer_Name: PUI Audio; Datasheet Link: https://api.puiaudio.com/filename/SMI-1324-TW-5V-3-R.pdf; Height: 7.5mm; Manufacturer_Part_Number: SMI-1324-TW-5V-3-R; Mouser Part Number: 665-SMI1324TW5V3R; Mouser Price/Stock: https://www.mouser.co.uk/ProductDetail/PUI-Audio/SMI-1324-TW-5V-3-R?qs=KCAtXnBvhdTXmKSoqYS0Mw%3D%3D
Q1 = PT334-6B: Phototransistor; Manufacturer_Name: Everlight; Datasheet Link: https://www.mouser.com/datasheet/2/143/PT334-6B-1663203.pdf; Manufacturer_Part_Number: PT334-6B; Mouser Part Number: 638-PT3346B; Mouser Price/Stock: https://www.mouser.co.uk/ProductDetail/Everlight/PT334-6B?qs=8PzhAHr7IdOmCssrIssUEQ%3D%3D; Arrow Part Number: PT334-6B; Arrow Price/Stock: https://www.arrow.com/en/products/pt334-6b/everlight-electronics?region=nac
R9-R12 = CRCW06034K70JNEAC: Resistor; Manufacturer_Name: Vishay; Datasheet Link: http://www.vishay.com/docs/28773/crcwce3.pdf; Height: 0.55mm; Manufacturer_Part_Number: CRCW06034K70JNEAC; Mouser Part Number: 71-CRCW06034K70JNEAC; Mouser Price/Stock: https://www.mouser.co.uk/ProductDetail/Vishay-Dale/CRCW06034K70JNEAC?qs=E3Y5ESvWgWMzBuUf0K3dnA%3D%3D; Arrow Part Number: CRCW06034K70JNEAC; Arrow Price/Stock: https://www.arrow.com/en/products/crcw06034k70jneac/vishay?region=nac
R13 R14 R25 = RC0603FR-071KL: Resistor; Manufacturer_Name: YAGEO; Datasheet Link: https://www.yageo.com/upload/media/product/productsearch/datasheet/rchip/PYu-RC_Group_51_RoHS_L_12.pdf; Height: 0.55mm; Manufacturer_Part_Number: RC0603FR-071KL; Mouser Part Number: 603-RC0603FR-071KL; Mouser Price/Stock: https://www.mouser.co.uk/ProductDetail/YAGEO/RC0603FR-071KL?qs=VU8sRB4EgwApHsk4rF%2F3zg%3D%3D; Arrow Part Number: RC0603FR-071KL; Arrow Price/Stock: https://www.arrow.com/en/products/rc0603fr-071kl/yageo?utm_currency=USD&region=nac
R15 = CRCW06031K00FKEA: CRCW0603 Resistor T/R 0.10W,1%,1K Vishay CRCW Series Thick Film Surface Mount Resistor 0603 Case 1k +/-1% 0.1W +/-100ppm/C; Geometry.Height: 0.5mm; Manufacturer_Name: Vishay; Manufacturer_Part_Number: CRCW06031K00FKEA; Mouser Part Number: 71-CRCW0603-1.0K-E3; Mouser Price/Stock: https://www.mouser.co.uk/ProductDetail/Vishay-Dale/CRCW06031K00FKEA?qs=CToX950LohJasujQx7GY3g%3D%3D; Arrow Part Number: CRCW06031K00FKEA; Arrow Price/Stock: https://www.arrow.com/en/products/crcw06031k00fkea/vishay?utm_currency=USD&region=nac; Datasheet Link: http://www.vishay.com/docs/20035/dcrcwe3.pdf
R20 = TNPW0603100RFHEA: Res Thin Film 0603 100 Ohm 1% 0.1W(1/10W) +/-50ppm/C Sulfur Resistant Pad SMD Automotive Medical T/R; Manufacturer_Name: Vishay; Geometry.Height: 0.55mm; Manufacturer_Part_Number: TNPW0603100RFHEA; Mouser Part Number: *; Mouser Price/Stock: *; Arrow Part Number: TNPW0603100RFHEA; Arrow Price/Stock: https://www.arrow.com/en/products/tnpw0603100rfhea/vishay; Datasheet Link: https://www.vishay.com/docs/28758/tnpw_e3.pdf
R21 = RCA0603100KFKEA: 100 kOhms +/-1% 0.1W, 1/10W Chip Resistor 0603 (1608 Metric) Anti-Sulfur, Automotive AEC-Q200 Thick Film; Manufacturer_Name: Vishay; Geometry.Height: 0.5mm; Manufacturer_Part_Number: RCA0603100KFKEA; Mouser Part Number: 71-RCA0603100KFKEA; Mouser Price/Stock: https://www.mouser.com/Search/Refine.aspx?Keyword=71-RCA0603100KFKEA; Arrow Part Number: RCA0603100KFKEA; Arrow Price/Stock: https://www.arrow.com/en/products/rca0603100kfkea/vishay?utm_currency=USD&region=nac; Datasheet Link: https://www.vishay.com/docs/20037/rcae3.pdf
VR1 = PT10MV11-104A2020-S: Variable Resistor; Manufacturer_Name: PIHER; Datasheet Link: https://www.piher.net/wp-content/uploads/PIHER_PT-10_PTC-10.pdf; Height: 6mm; Manufacturer_Part_Number: PT10MV11-104A2020-S; Mouser Part Number: 531-PT10MV11104A22S; Mouser Price/Stock: https://www.mouser.co.uk/ProductDetail/Amphenol-Piher/PT10MV11-104A2020-S?qs=byeeYqUIh0P%252Byx82Crbo6w%3D%3D

## Sheet Sheet5.SchDoc
size A4; SheetNumber: 5; SheetTotal: 6
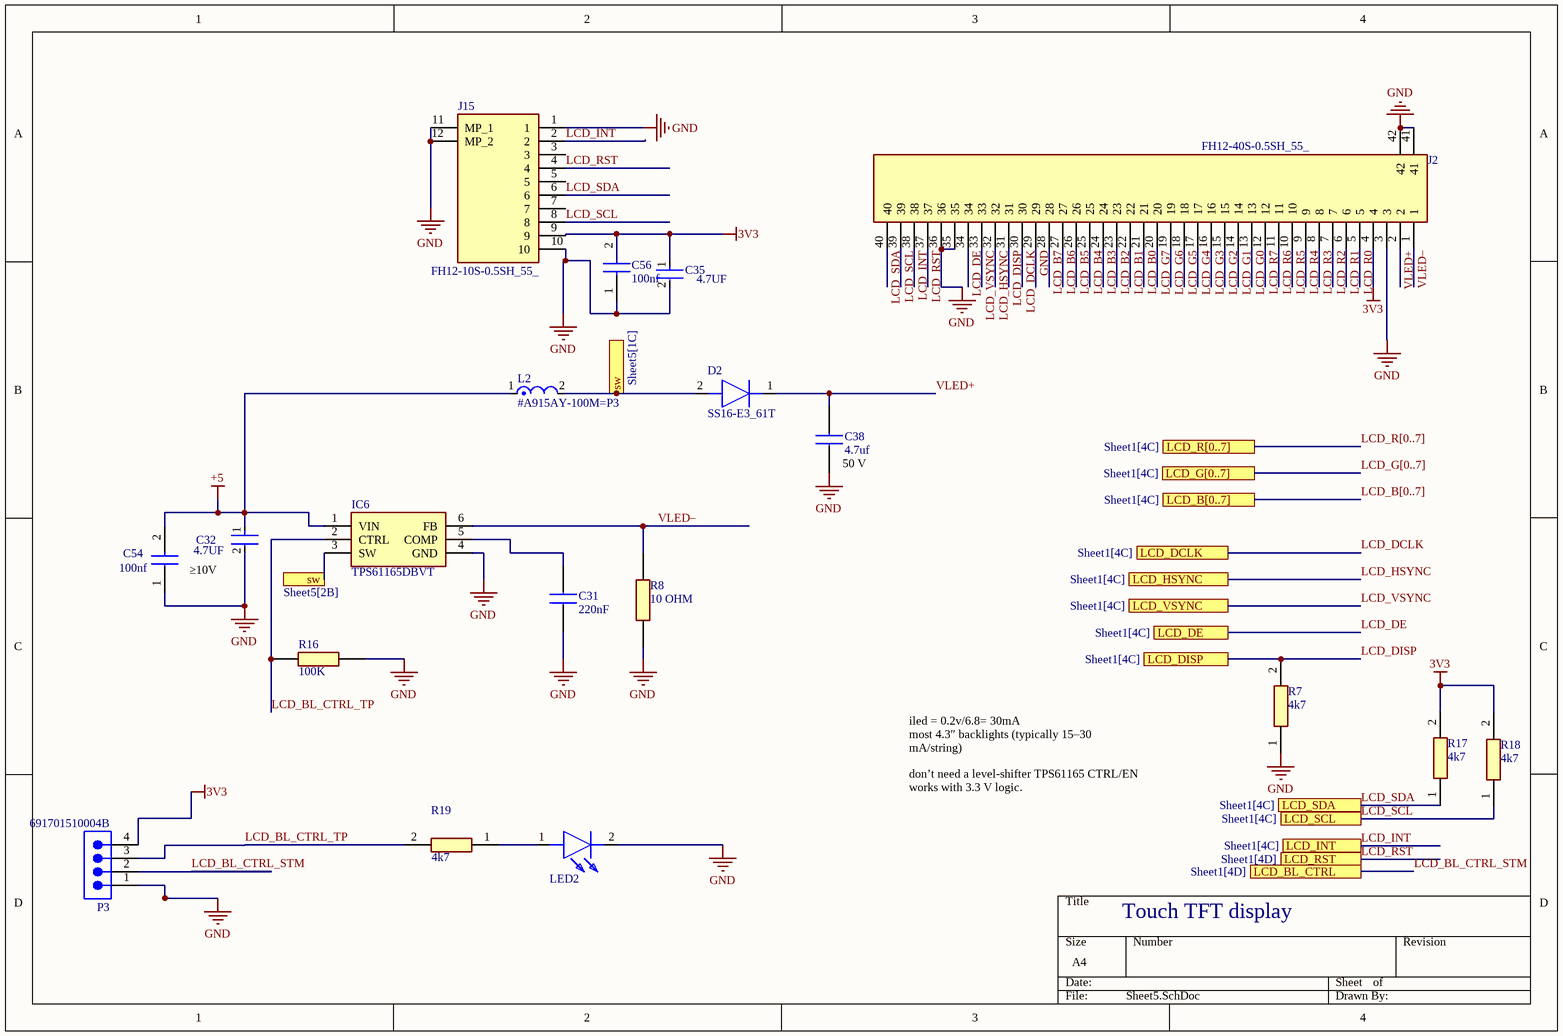
[diagram p4: Sheet5.SchDoc]

### Parts
C31  220nF  [CAPC1608X87N]
C32  4.7UF  [FP-CL10-IPC_A]
C35  4.7UF  [FP-CL10-IPC_A]
C38  4.7uf  [CAPC1608X95N]
C54  100nf  [CAPC1608X95N]
C56  100nf  [CAPC1608X95N]
D2  SS16-E3_61T  [DIOM5127X229N]
IC6  TPS61165DBVT  [SOT95P280X145-6N]
J2  FH12-40S-0.5SH_55_  [FH1240S05SH55]
J15  FH12-10S-0.5SH_55_  [FH1210S05SH55]
L2  #A915AY-100M=P3  [FP-D53LC-MFG]
LED2  KPTL-3216SURCK-01-VS  [KPTL3216SURCK01VS]  (value not drawn)
P3  691701510004B  [691701510004B]
R7  4k7  [RESC1608X55N]
R8  10 OHM  [RESC1608X50N]
R16  100K  [RESC1608X50N]
R17  4k7  [RESC1608X55N]
R18  4k7  [RESC1608X55N]
R19  4k7  [RESC1608X55N]

### Ports
LCD_B[0..7] (see Sheet1[4C]), LCD_BL_CTRL (see Sheet1[4D]), LCD_DCLK (see Sheet1[4C]), LCD_DE (see Sheet1[4C]), LCD_DISP (see Sheet1[4C]), LCD_G[0..7] (see Sheet1[4C]), LCD_HSYNC (see Sheet1[4C]), LCD_INT (see Sheet1[4C]), LCD_R[0..7] (see Sheet1[4C]), LCD_RST (see Sheet1[4D]), LCD_SCL (see Sheet1[4C]), LCD_SDA (see Sheet1[4C]), LCD_VSYNC (see Sheet1[4C]), sw (see Sheet5[1C]), sw (see Sheet5[2B])

### Nets
3V3: C35.1 C56.2 J2.4 J15.9 P3.4 R17.2 R18.2
+5: C32.1 C54.2 IC6.1(VIN) L2.1
GND: C31.1 C32.2 C35.2 C38.1 C54.1 C56.1 IC6.4(GND) J2.3 J2.29 J2.35 J2.36 J2.41 J2.42 J15.1 J15.10 J15.11(MP_1) J15.12(MP_2) LED2.2(K) P3.1 R7.1 R8.1 R16.2
LCD_B0: J2.21
LCD_B1: J2.22
LCD_B2: J2.23
LCD_B3: J2.24
LCD_B4: J2.25
LCD_B5: J2.26
LCD_B6: J2.27
LCD_B7: J2.28
LCD_BL_CTRL_STM: P3.2 ; port LCD_BL_CTRL  [project net LCD_BL_CTRL]
LCD_BL_CTRL_TP: IC6.2(CTRL) P3.3 R16.1 R19.2
LCD_DCLK: J2.30 ; port LCD_DCLK
LCD_DE: J2.34 ; port LCD_DE
LCD_DISP: J2.31 R7.2 ; port LCD_DISP
LCD_G0: J2.13
LCD_G1: J2.14
LCD_G2: J2.15
LCD_G3: J2.16
LCD_G4: J2.17
LCD_G5: J2.18
LCD_G6: J2.19
LCD_G7: J2.20
LCD_HSYNC: J2.32 ; port LCD_HSYNC
LCD_INT: J2.38 J15.2 ; port LCD_INT
LCD_R0: J2.5
LCD_R1: J2.6
LCD_R2: J2.7
LCD_R3: J2.8
LCD_R4: J2.9
LCD_R5: J2.10
LCD_R6: J2.11
LCD_R7: J2.12
LCD_RST: J2.37 J15.4 ; port LCD_RST
LCD_SCL: J2.39 J15.8 R18.1 ; port LCD_SCL
LCD_SDA: J2.40 J15.6 R17.1 ; port LCD_SDA
LCD_VSYNC: J2.33 ; port LCD_VSYNC
VLED+: C38.2 D2.1(K) J2.2
VLED–: IC6.6(FB) J2.1 R8.2
NetC31_2: C31.2 IC6.5(COMP)
NetD2_2: D2.2(A) IC6.3(SW) L2.2 ; port sw
NetLED2_1: LED2.1(A) R19.1

Not connected (* = marked no-connect by the designer): J15 3 5 7

### Buses and harness runs
bus LCD_B[0..7] = port LCD_B[0..7]
bus LCD_G[0..7] = port LCD_G[0..7]
bus LCD_R[0..7] = port LCD_R[0..7]

### Notes on the sheet
- (near C38) 50 V
- ≥10V
- iled = 0.2v/6.8= 30mA                                most 4.3″ backlights (typically 15–30 mA/string)
- don’t need a level-shifter TPS61165 CTRL/EN works with 3.3 V logic.
- Touch TFT display

### Library data of the parts
C31 = 0603B223K500CT: WALSIN - 0603B223K500CT - CAPACITOR, MLCC, X7R, 0.022UF, 50V, 0603; Manufacturer_Name: Walsin Technology Corporation; Geometry.Height: 0.87mm; Manufacturer_Part_Number: 0603B223K500CT; Mouser Part Number: 791-0603B223K500CT; Mouser Price/Stock: https://www.mouser.co.uk/ProductDetail/Walsin/0603B223K500CT?qs=fIkAfuXiAQLm86jiyfZMMQ%3D%3D; Arrow Part Number: 0603B223K500CT; Arrow Price/Stock: https://www.arrow.com/en/products/0603b223k500ct/walsin-technology; Datasheet Link: https://componentsearchengine.com/Datasheets/2/0603B223K500CT.pdf
C32 C35 = CMP-13271-003582-1: as C3 on sheet Sheet3; Max Operating Temperature: 125°C; Package Quantity: 1; Thickness: 0.035inch; Capacitance: 2.2uF; Height: 0.8mm; Case/Package: 0603; Case Code (Metric): 1608; Radiation Hardening: No; Dielectric: X7R; Mount: Surface Mount; Contact Plating: Tin; Material: Ceramic; Length: 1.6mm; Packaging: Tape and Reel; Width: 0.031inch; Min Operating Temperature: -55°C; Case Code (Imperial): 0603; Depth: 0.8mm; Voltage Rating: 10V; Tolerance: 10%
C38 = 0603X105K250CT: as C1 on sheet Sheet3; Manufacturer_Part_Number: 0603X105K250CT; Mouser Part Number: *; Mouser Price/Stock: *; Arrow Part Number: *; Arrow Price/Stock: *; Datasheet Link: https://g.componentsearchengine.com/Datasheets/2/0603X105K250CT.pdf
C54 C56 = VJ0603Y104KXACW1BC: Capacitor; Manufacturer_Name: Vishay; Datasheet Link: https://componentsearchengine.com/Datasheets/2/VJ0603Y104KXACW1BC.pdf; Height: 0.95mm; Manufacturer_Part_Number: VJ0603Y104KXACW1BC; Mouser Part Number: N/A; Mouser Price/Stock: https://www.mouser.co.uk/ProductDetail/Vishay-Vitramon/VJ0603Y104KXACW1BC?qs=M%2FcR%2FDpCXFVPJpohemA31Q%3D%3D; Arrow Part Number: VJ0603Y104KXACW1BC; Arrow Price/Stock: https://www.arrow.com/en/products/vj0603y104kxacw1bc/vishay?utm_currency=USD&region=nac
D2 = SS16-E3_61T: Diode; Manufacturer_Name: Vishay; Manufacturer_Part_Number: SS16-E3/61T; Datasheet Link: https://componentsearchengine.com/Datasheets/2/SS16-E3_61T.pdf; Height: 2.29mm; Mouser Part Number: 625-SS16-E3; Mouser Price/Stock: https://www.mouser.co.uk/ProductDetail/Vishay-General-Semiconductor/SS16-E3-61T?qs=x2jpVgRnAtMiLlJLdPGu3w%3D%3D; Arrow Part Number: SS16-E3/61T; Arrow Price/Stock: https://www.arrow.com/en/products/ss16-e361t/vishay?utm_currency=USD&region=europe
IC6 = TPS61165DBVT: Integrated Circuit; Manufacturer_Name: Texas Instruments; Datasheet Link: http://www.ti.com/lit/gpn/tps61165; Height: 1.45mm; Manufacturer_Part_Number: TPS61165DBVT; Mouser Part Number: 595-TPS61165DBVT; Mouser Price/Stock: https://www.mouser.co.uk/ProductDetail/Texas-Instruments/TPS61165DBVT?qs=HM7Ob9npyBILp76tdVJPyQ%3D%3D; Arrow Part Number: TPS61165DBVT; Arrow Price/Stock: https://www.arrow.com/en/products/tps61165dbvt/texas-instruments?utm_currency=USD&region=nac
J2 = FH12-40S-0.5SH_55_: Connector; Manufacturer_Name: Hirose; Manufacturer_Part_Number: FH12-40S-0.5SH(55); Datasheet Link: https://datasheet.datasheetarchive.com/originals/distributors/SFDatasheet-1/sf-00023459.pdf; Height: 2mm; Mouser Part Number: 798-FH12-40S-0.5SH55; Mouser Price/Stock: https://www.mouser.co.uk/ProductDetail/Hirose-Connector/FH12-40S-0.5SH55?qs=Ux3WWAnHpjCB5TtHwQqTgA%3D%3D; Arrow Part Number: FH12-40S-0.5SH(55); Arrow Price/Stock: https://www.arrow.com/en/products/fh12-40s-0.5sh-55/hirose-electric
J15 = FH12-10S-0.5SH_55_: Connector; Manufacturer_Name: Hirose; Manufacturer_Part_Number: FH12-10S-0.5SH(55); Datasheet Link: https://www.mouser.com/datasheet/3/731/1/FH12_10S_0.5SH_55__CL0586_0522_3_55_2DDrawing_0000987484.pdf; Height: 2.2mm; Mouser Part Number: 798-FH12-10S-0.5SH55; Mouser Price/Stock: https://www.mouser.co.uk/ProductDetail/Hirose-Connector/FH12-10S-0.5SH55?qs=Ux3WWAnHpjDbjH5OXeBUGQ%3D%3D; Arrow Part Number: FH12-10S-0.5SH(55); Arrow Price/Stock: null?utm_currency=USD&region=nac
L2 = CMP-06042-000140-1: FIXED IND 10UH 1.49A 90 MOHM SMD; Tolerance: 20%; Case/Package: 2020; Length: 5.2mm
LED2 = KPTL-3216SURCK-01-VS: LED; Manufacturer_Name: Kingbright; Datasheet Link: http://www.farnell.com/datasheets/1655872.pdf; Height: 1.2mm; Manufacturer_Part_Number: KPTL-3216SURCK-01-VS; Mouser Part Number: N/A; Mouser Price/Stock: https://www.mouser.co.uk/ProductDetail/Kingbright/KPTL-3216SURCK-01-VS?qs=5DWHFlm3M2sATWsF9Oia%2FA%3D%3D
P3 = CMP-1502-02331-3: Terminal Block, 5.08MM, Close Vertical Pcb Header, Thr Type, 4 Pins; Number of Contacts: 4; Voltage Rating: 300V; Current Rating: 10A; Gender: Male; Contact Material: Brass; Number of Pins: 4; REACH SVHC: Unknown; Lead Pitch: 5.08mm; Connector Type: Terminal Block; Max Operating Temperature: 105°C; Min Operating Temperature: -40°C; Housing Material: Polymer; Contact Plating: Tin; Mount: Through Hole; RoHS: Compliant; Color: Black; Pitch: 5.08mm; Length: 23.12mm; Termination: PCB
R7 R17-R19 = CRCW06034K70JNEAC: Resistor; Manufacturer_Name: Vishay; Datasheet Link: http://www.vishay.com/docs/28773/crcwce3.pdf; Height: 0.55mm; Manufacturer_Part_Number: CRCW06034K70JNEAC; Mouser Part Number: 71-CRCW06034K70JNEAC; Mouser Price/Stock: https://www.mouser.co.uk/ProductDetail/Vishay-Dale/CRCW06034K70JNEAC?qs=E3Y5ESvWgWMzBuUf0K3dnA%3D%3D; Arrow Part Number: CRCW06034K70JNEAC; Arrow Price/Stock: https://www.arrow.com/en/products/crcw06034k70jneac/vishay?region=nac
R8 = RCA0603100KFKEA: AR03BTCX6R80; Manufacturer_Name: Vishay; Geometry.Height: 0.5mm; Manufacturer_Part_Number: RCA0603100KFKEA; Mouser Part Number: 71-RCA0603100KFKEA; Mouser Price/Stock: https://www.mouser.com/Search/Refine.aspx?Keyword=71-RCA0603100KFKEA; Arrow Part Number: RCA0603100KFKEA; Arrow Price/Stock: https://www.arrow.com/en/products/rca0603100kfkea/vishay?utm_currency=USD&region=nac; Datasheet Link: https://www.vishay.com/docs/20037/rcae3.pdf
R16 = RCA0603100KFKEA: as R21 on sheet Sheet4; Manufacturer_Part_Number: RCA0603100KFKEA; Mouser Part Number: 71-RCA0603100KFKEA; Mouser Price/Stock: https://www.mouser.com/Search/Refine.aspx?Keyword=71-RCA0603100KFKEA; Arrow Part Number: RCA0603100KFKEA; Arrow Price/Stock: https://www.arrow.com/en/products/rca0603100kfkea/vishay?utm_currency=USD&region=nac; Datasheet Link: https://www.vishay.com/docs/20037/rcae3.pdf

## Sheet Sheet6.SchDoc
size A4; SheetNumber: 6; SheetTotal: 6
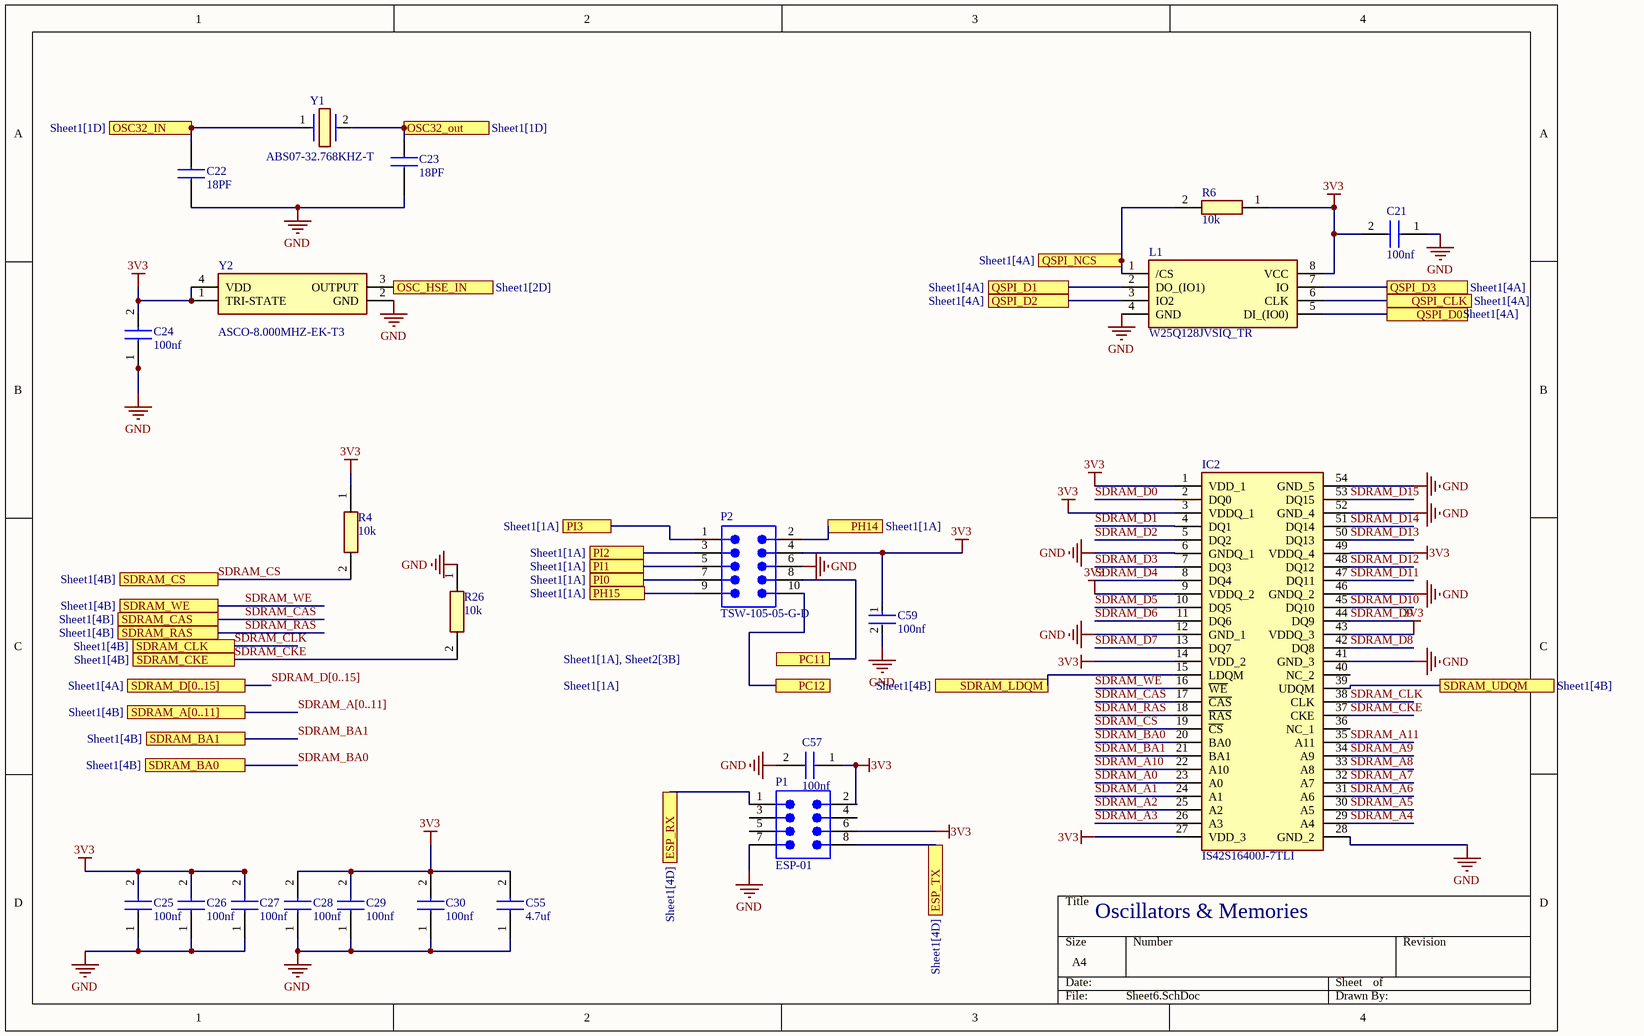
[diagram p5: Sheet6.SchDoc]

### Parts
C21  100nf  [CAPC1608X95N]
C22  18PF  [CAPC1608X87N]
C23  18PF  [CAPC1608X87N]
C24  100nf  [CAPC1608X95N]
C25  100nf  [CAPC1608X95N]
C26  100nf  [CAPC1608X95N]
C27  100nf  [CAPC1608X95N]
C28  100nf  [CAPC1608X95N]
C29  100nf  [CAPC1608X95N]
C30  100nf  [CAPC1608X95N]
C55  4.7uf  [CAPC1608X95N]
C57  100nf  [CAPC1608X95N]
C59  100nf  [FP-VJ0603X-MFG]
IC2  IS42S16400J-7TLI  [SOP80P1176X120-54N]
L1  W25Q128JVSIQ_TR  [SOIC127P780X195-8N]
P1  ESP-01  [SMTC-MTSW-104-12-X-D-006]
P2  TSW-105-05-G-D  [SMTC-TSW-105-05-X-D]
R4  10k  [RESC1608X55N]
R6  10k  [RESC1608X55N]
R26  10k  [RESC1608X55N]
Y1  ABS07-32.768KHZ-T  [ABS07]
Y2  ASCO-8.000MHZ-EK-T3  [ASCO16000MHZEKT]

### Ports
ESP_RX (see Sheet1[4D]), ESP_TX (see Sheet1[4D]), OSC32_IN (see Sheet1[1D]), OSC32_out (see Sheet1[1D]), OSC_HSE_IN (see Sheet1[2D]), PC11 (see Sheet1[1A], Sheet2[3B]), PC12 (see Sheet1[1A]), PH14 (see Sheet1[1A]), PH15 (see Sheet1[1A]), PI0 (see Sheet1[1A]), PI1 (see Sheet1[1A]), PI2 (see Sheet1[1A]), PI3 (see Sheet1[1A]), QSPI_CLK (see Sheet1[4A]), QSPI_D0 (see Sheet1[4A]), QSPI_D1 (see Sheet1[4A]), QSPI_D2 (see Sheet1[4A]), QSPI_D3 (see Sheet1[4A]), QSPI_NCS (see Sheet1[4A]), SDRAM_A[0..11] (see Sheet1[4B]), SDRAM_BA0 (see Sheet1[4B]), SDRAM_BA1 (see Sheet1[4B]), SDRAM_CAS (see Sheet1[4B]), SDRAM_CKE (see Sheet1[4B]), SDRAM_CLK (see Sheet1[4B]), SDRAM_CS (see Sheet1[4B]), SDRAM_D[0..15] (see Sheet1[4A]), SDRAM_LDQM (see Sheet1[4B]), SDRAM_RAS (see Sheet1[4B]), SDRAM_UDQM (see Sheet1[4B]), SDRAM_WE (see Sheet1[4B])

### Nets
3V3: C21.2 C24.2 C25.2 C26.2 C27.2 C28.2 C29.2 C30.2 C55.2 C57.1 C59.1 IC2.1(VDD_1) IC2.3(VDDQ_1) IC2.9(VDDQ_2) IC2.14(VDD_2) IC2.27(VDD_3) IC2.43(VDDQ_3) IC2.49(VDDQ_4) L1.8(VCC) P1.2 P1.6 P2.4 R4.1 R6.1 Y2.1(TRI-STATE) Y2.4(VDD)
GND: C21.1 C22.1 C23.1 C24.1 C25.1 C26.1 C27.1 C28.1 C29.1 C30.1 C55.1 C57.2 C59.2 IC2.6(GNDQ_1) IC2.12(GND_1) IC2.28(GND_2) IC2.41(GND_3) IC2.46(GNDQ_2) IC2.52(GND_4) IC2.54(GND_5) P1.7 P2.6 R26.1 Y2.2(GND)
ESP_RX: P1.1 ; port ESP_RX
ESP_TX: P1.8 ; port ESP_TX
QSPI_CLK: L1.6(CLK) ; port QSPI_CLK
QSPI_D0: L1.5(DI_(IO0)) ; port QSPI_D0
QSPI_D1: L1.2(DO_(IO1)) ; port QSPI_D1
QSPI_D2: L1.3(IO2) ; port QSPI_D2
QSPI_D3: L1.7(IO) ; port QSPI_D3
QSPI_NCS: L1.1(/CS) R6.2 ; port QSPI_NCS
SDRAM_A0: IC2.23(A0)
SDRAM_A1: IC2.24(A1)
SDRAM_A2: IC2.25(A2)
SDRAM_A3: IC2.26(A3)
SDRAM_A4: IC2.29(A4)
SDRAM_A5: IC2.30(A5)
SDRAM_A6: IC2.31(A6)
SDRAM_A7: IC2.32(A7)
SDRAM_A8: IC2.33(A8)
SDRAM_A9: IC2.34(A9)
SDRAM_A10: IC2.22(A10)
SDRAM_A11: IC2.35(A11)
SDRAM_BA0: IC2.20(BA0) ; port SDRAM_BA0
SDRAM_BA1: IC2.21(BA1) ; port SDRAM_BA1
SDRAM_CAS: IC2.17(~{CAS}) ; port SDRAM_CAS
SDRAM_CKE: IC2.37(CKE) R26.2 ; port SDRAM_CKE
SDRAM_CLK: IC2.38(CLK) ; port SDRAM_CLK
SDRAM_CS: IC2.19(~{CS}) R4.2 ; port SDRAM_CS
SDRAM_D0: IC2.2(DQ0)
SDRAM_D1: IC2.4(DQ1)
SDRAM_D2: IC2.5(DQ2)
SDRAM_D3: IC2.7(DQ3)
SDRAM_D4: IC2.8(DQ4)
SDRAM_D5: IC2.10(DQ5)
SDRAM_D6: IC2.11(DQ6)
SDRAM_D7: IC2.13(DQ7)
SDRAM_D8: IC2.42(DQ8)
SDRAM_D9: IC2.44(DQ9)
SDRAM_D10: IC2.45(DQ10)
SDRAM_D11: IC2.47(DQ11)
SDRAM_D12: IC2.48(DQ12)
SDRAM_D13: IC2.50(DQ13)
SDRAM_D14: IC2.51(DQ14)
SDRAM_D15: IC2.53(DQ15)
SDRAM_LDQM: IC2.15(LDQM) ; port SDRAM_LDQM
SDRAM_RAS: IC2.18(~{RAS}) ; port SDRAM_RAS
SDRAM_UDQM: IC2.39(UDQM) ; port SDRAM_UDQM
SDRAM_WE: IC2.16(~{WE}) ; port SDRAM_WE
NetC22_2: C22.2 Y1.1 ; port OSC32_IN
NetC23_2: C23.2 Y1.2 ; port OSC32_out
NetIC1_32: Y2.3(OUTPUT) ; port OSC_HSE_IN
NetIC1_151: P2.9 ; port PH15
NetIC1_152: P2.2 ; port PH14
NetIC1_154: P2.7 ; port PI0
NetIC1_155: P2.5 ; port PI1
NetIC1_156: P2.3 ; port PI2
NetIC1_157: P2.1 ; port PI3
NetIC1_162: P2.8 ; port PC11
NetIC1_163: P2.10 ; port PC12

Not connected (* = marked no-connect by the designer): IC2 36(NC_1) 40(NC_2); L1 4(GND); P1 3 4 5

### Buses and harness runs
bus SDRAM_A[0..11] = port SDRAM_A[0..11]
bus SDRAM_D[0..15] = port SDRAM_D[0..15]

### Notes on the sheet
- Oscillators & Memories
- Labels drawn without touching a wire or pin: GND

### Library data of the parts
C21 C24-C30 C55 C57 = VJ0603Y104KXACW1BC: Capacitor; Manufacturer_Name: Vishay; Datasheet Link: https://componentsearchengine.com/Datasheets/2/VJ0603Y104KXACW1BC.pdf; Height: 0.95mm; Manufacturer_Part_Number: VJ0603Y104KXACW1BC; Mouser Part Number: N/A; Mouser Price/Stock: https://www.mouser.co.uk/ProductDetail/Vishay-Vitramon/VJ0603Y104KXACW1BC?qs=M%2FcR%2FDpCXFVPJpohemA31Q%3D%3D; Arrow Part Number: VJ0603Y104KXACW1BC; Arrow Price/Stock: https://www.arrow.com/en/products/vj0603y104kxacw1bc/vishay?utm_currency=USD&region=nac
C22 C23 = C0603C180J5GAC: Multilayer Ceramic Capacitors MLCC - SMD/SMT 50volts 18pF 5% C0G; Manufacturer_Name: KEMET; Geometry.Height: 0.87mm; Manufacturer_Part_Number: C0603C180J5GAC; Mouser Part Number: 80-C0603C180J5GAC; Mouser Price/Stock: https://www.mouser.co.uk/ProductDetail/KEMET/C0603C180J5GAC?qs=zJdl%252BU%252B%2Fz2ks8AeO5ySrAw%3D%3D; Arrow Part Number: *; Arrow Price/Stock: *; Datasheet Link: https://content.kemet.com/datasheets/KEM_C1003_C0G_SMD.pdf
C59 = CMP-02417-000051-1: CAP CER 0.1UF 50V X7R 0603; Tolerance: 10%; Dielectric Material: Tantalum; Capacitance: 100nF; Case/Package: 0603; Construction: Flat; Radiation Hardening: No; Dielectric: X7R; Mount: Surface Mount; Min Operating Temperature: -55°C; Length: 1.6mm; RoHS Compliant: Yes; Case Code (Imperial): 0603; Contact Plating: Tin; Voltage Rating (DC): 50V; Lead Free: Lead Free; Packaging: Cut Tape; Max Operating Temperature: 125°C; Case Code (Metric): 1608; Voltage Rating: 50V; Voltage: 50V; Depth: 0.8mm
IC2 = IS42S16400J-7TLI: Integrated Circuit; Manufacturer_Name: Integrated Silicon Solution Inc.; Datasheet Link: http://www.issi.com/WW/pdf/42-45S16400J.pdf; Height: 1.2mm; Manufacturer_Part_Number: IS42S16400J-7TLI; Mouser Part Number: 870-IS42S16400J-7TLI; Mouser Price/Stock: https://www.mouser.co.uk/ProductDetail/ISSI/IS42S16400J-7TLI?qs=eOmjsnl%2FhF6IYGbICFWNhg%3D%3D; Arrow Part Number: IS42S16400J-7TLI; Arrow Price/Stock: https://www.arrow.com/en/products/is42s16400j-7tli/integrated-silicon-solution-inc?utm_currency=USD&region=nac
L1 = W25Q128JVSIQ_TR: Inductor; Manufacturer_Name: Winbond; Manufacturer_Part_Number: W25Q128JVSIQ TR; Datasheet Link: http://www.winbond.com/resource-files/w25q128jv%20spi%20revc%2011162016.pdf; Height: 1.95mm; Mouser Part Number: 454-W25Q128JVSIQTR; Mouser Price/Stock: https://www.mouser.co.uk/ProductDetail/Winbond/W25Q128JVSIQ-TR?qs=qSfuJ%252Bfl%2Fd7vTyLA9kNdGw%3D%3D; Arrow Part Number: W25Q128JVSIQ TR; Arrow Price/Stock: https://www.arrow.com/en/products/w25q128jvsiqtr/winbond-electronics?utm_currency=USD&region=nac
P1 = CMP-1024-00110-1: Modified .025" SQ Post Header, Through-hole, Vertical, -55 to 105 degC, 2.54 mm Pitch, 8-Pin, Male, RoHS; PartNumber: MTSW-104-12-T-D-006; Manufacturer: Samtec; Pitch: 2.54 mm; ComponentLink3URL: http://www.samtec.com/documents/webfiles/cpdf/MTSW-XXX-XX-X-X-XXXX-XX-XXX-MKT1.pdf; Temperature Range: -55 to 105 degC; Orientation: Vertical; ComponentLink1URL: http://www.samtec.com; PackageDescription: Assembly .025" [.64] SQ Post Terminal Strip; ComponentLink3Description: Package Specification; ComponentLink2URL: http://www.samtec.com/documents/webfiles/pdf/MTSW.PDF; ComponentLink2Description: Datasheet; PackageReference: MTSW-104-12-X-D-006; DatasheetVersion: F-214; Mounting Technology: Through-hole; RoHS: True; PackageVersion: BI, 2/1987; ComponentLink1Description: Manufacturer URL
P2 = CMP-1024-00362-1: 0.025" SQ Post Header, Through-hole, Vertical, -55 to 125 degC, 2.54 mm Pitch, 10-Pin, Male, RoHS; Manufacturer: Samtec; Pitch: 2.54 mm; Temperature Range: -55 to 125 degC; ComponentLink3URL: http://www.samtec.com/documents/webfiles/cpdf/TSW-XXX-XX-XXX-X-XX-XXX-MKT.pdf; ComponentLink2Description: Datasheet; Mounting Technology: Through-hole; ComponentLink3Description: Package Specification; RoHS: True; ComponentLink1URL: http://www.samtec.com; PackageVersion: DM, 8/1988; PartNumber: TSW-105-05-G-D; PackageReference: TSW-105-05-X-D; DatasheetVersion: F-214; ComponentLink2URL: http://www.samtec.com/documents/webfiles/pdf/TSW_TH.PDF; PackageDescription: .025[0.64] SQ. Post Terminal Strip Assembly; Orientation: Vertical; ComponentLink1Description: Manufacturer URL
R4 R6 R26 = RC0603FR-071KL: Resistor; Manufacturer_Name: YAGEO; Datasheet Link: https://www.yageo.com/upload/media/product/productsearch/datasheet/rchip/PYu-RC_Group_51_RoHS_L_12.pdf; Height: 0.55mm; Manufacturer_Part_Number: RC0603FR-071KL; Mouser Part Number: 603-RC0603FR-071KL; Mouser Price/Stock: https://www.mouser.co.uk/ProductDetail/YAGEO/RC0603FR-071KL?qs=VU8sRB4EgwApHsk4rF%2F3zg%3D%3D; Arrow Part Number: RC0603FR-071KL; Arrow Price/Stock: https://www.arrow.com/en/products/rc0603fr-071kl/yageo?utm_currency=USD&region=nac
Y1 = ABS07-32.768KHZ-T: Crystal or Oscillator; Manufacturer_Name: ABRACON; Datasheet Link: https://abracon.com/Resonators/ABS07.pdf; Height: 0.9mm; Manufacturer_Part_Number: ABS07-32.768KHZ-T; Mouser Part Number: 815-ABS07-32.768KHZT; Mouser Price/Stock: https://www.mouser.co.uk/ProductDetail/ABRACON/ABS07-32.768KHZ-T?qs=3SpAxaLJ01g8GJWeO3sA3Q%3D%3D; Arrow Part Number: ABS07-32.768KHZ-T; Arrow Price/Stock: https://www.arrow.com/en/products/abs07-32.768khz-t/abracon?utm_currency=USD&region=europe
Y2 = ASCO-8.000MHZ-EK-T3: Crystal or Oscillator; Manufacturer_Name: ABRACON; Datasheet Link: https://abracon.com/Oscillators/ASCO.pdf; Height: 0mm; Manufacturer_Part_Number: ASCO-8.000MHZ-EK-T3; Mouser Part Number: 815-ASCO-8-EK-T3; Mouser Price/Stock: https://www.mouser.co.uk/ProductDetail/ABRACON/ASCO-8000MHZ-EK-T3?qs=DffVzuaNd2xxqtOgFaJTHg%3D%3D; Arrow Part Number: ASCO-8.000MHZ-EK-T3; Arrow Price/Stock: https://www.arrow.com/en/products/asco-8.000mhz-ek-t3/abracon?utm_currency=USD&region=nac